# Altium project iMX8M_CPU.PrjPcb (part 1 of 2)
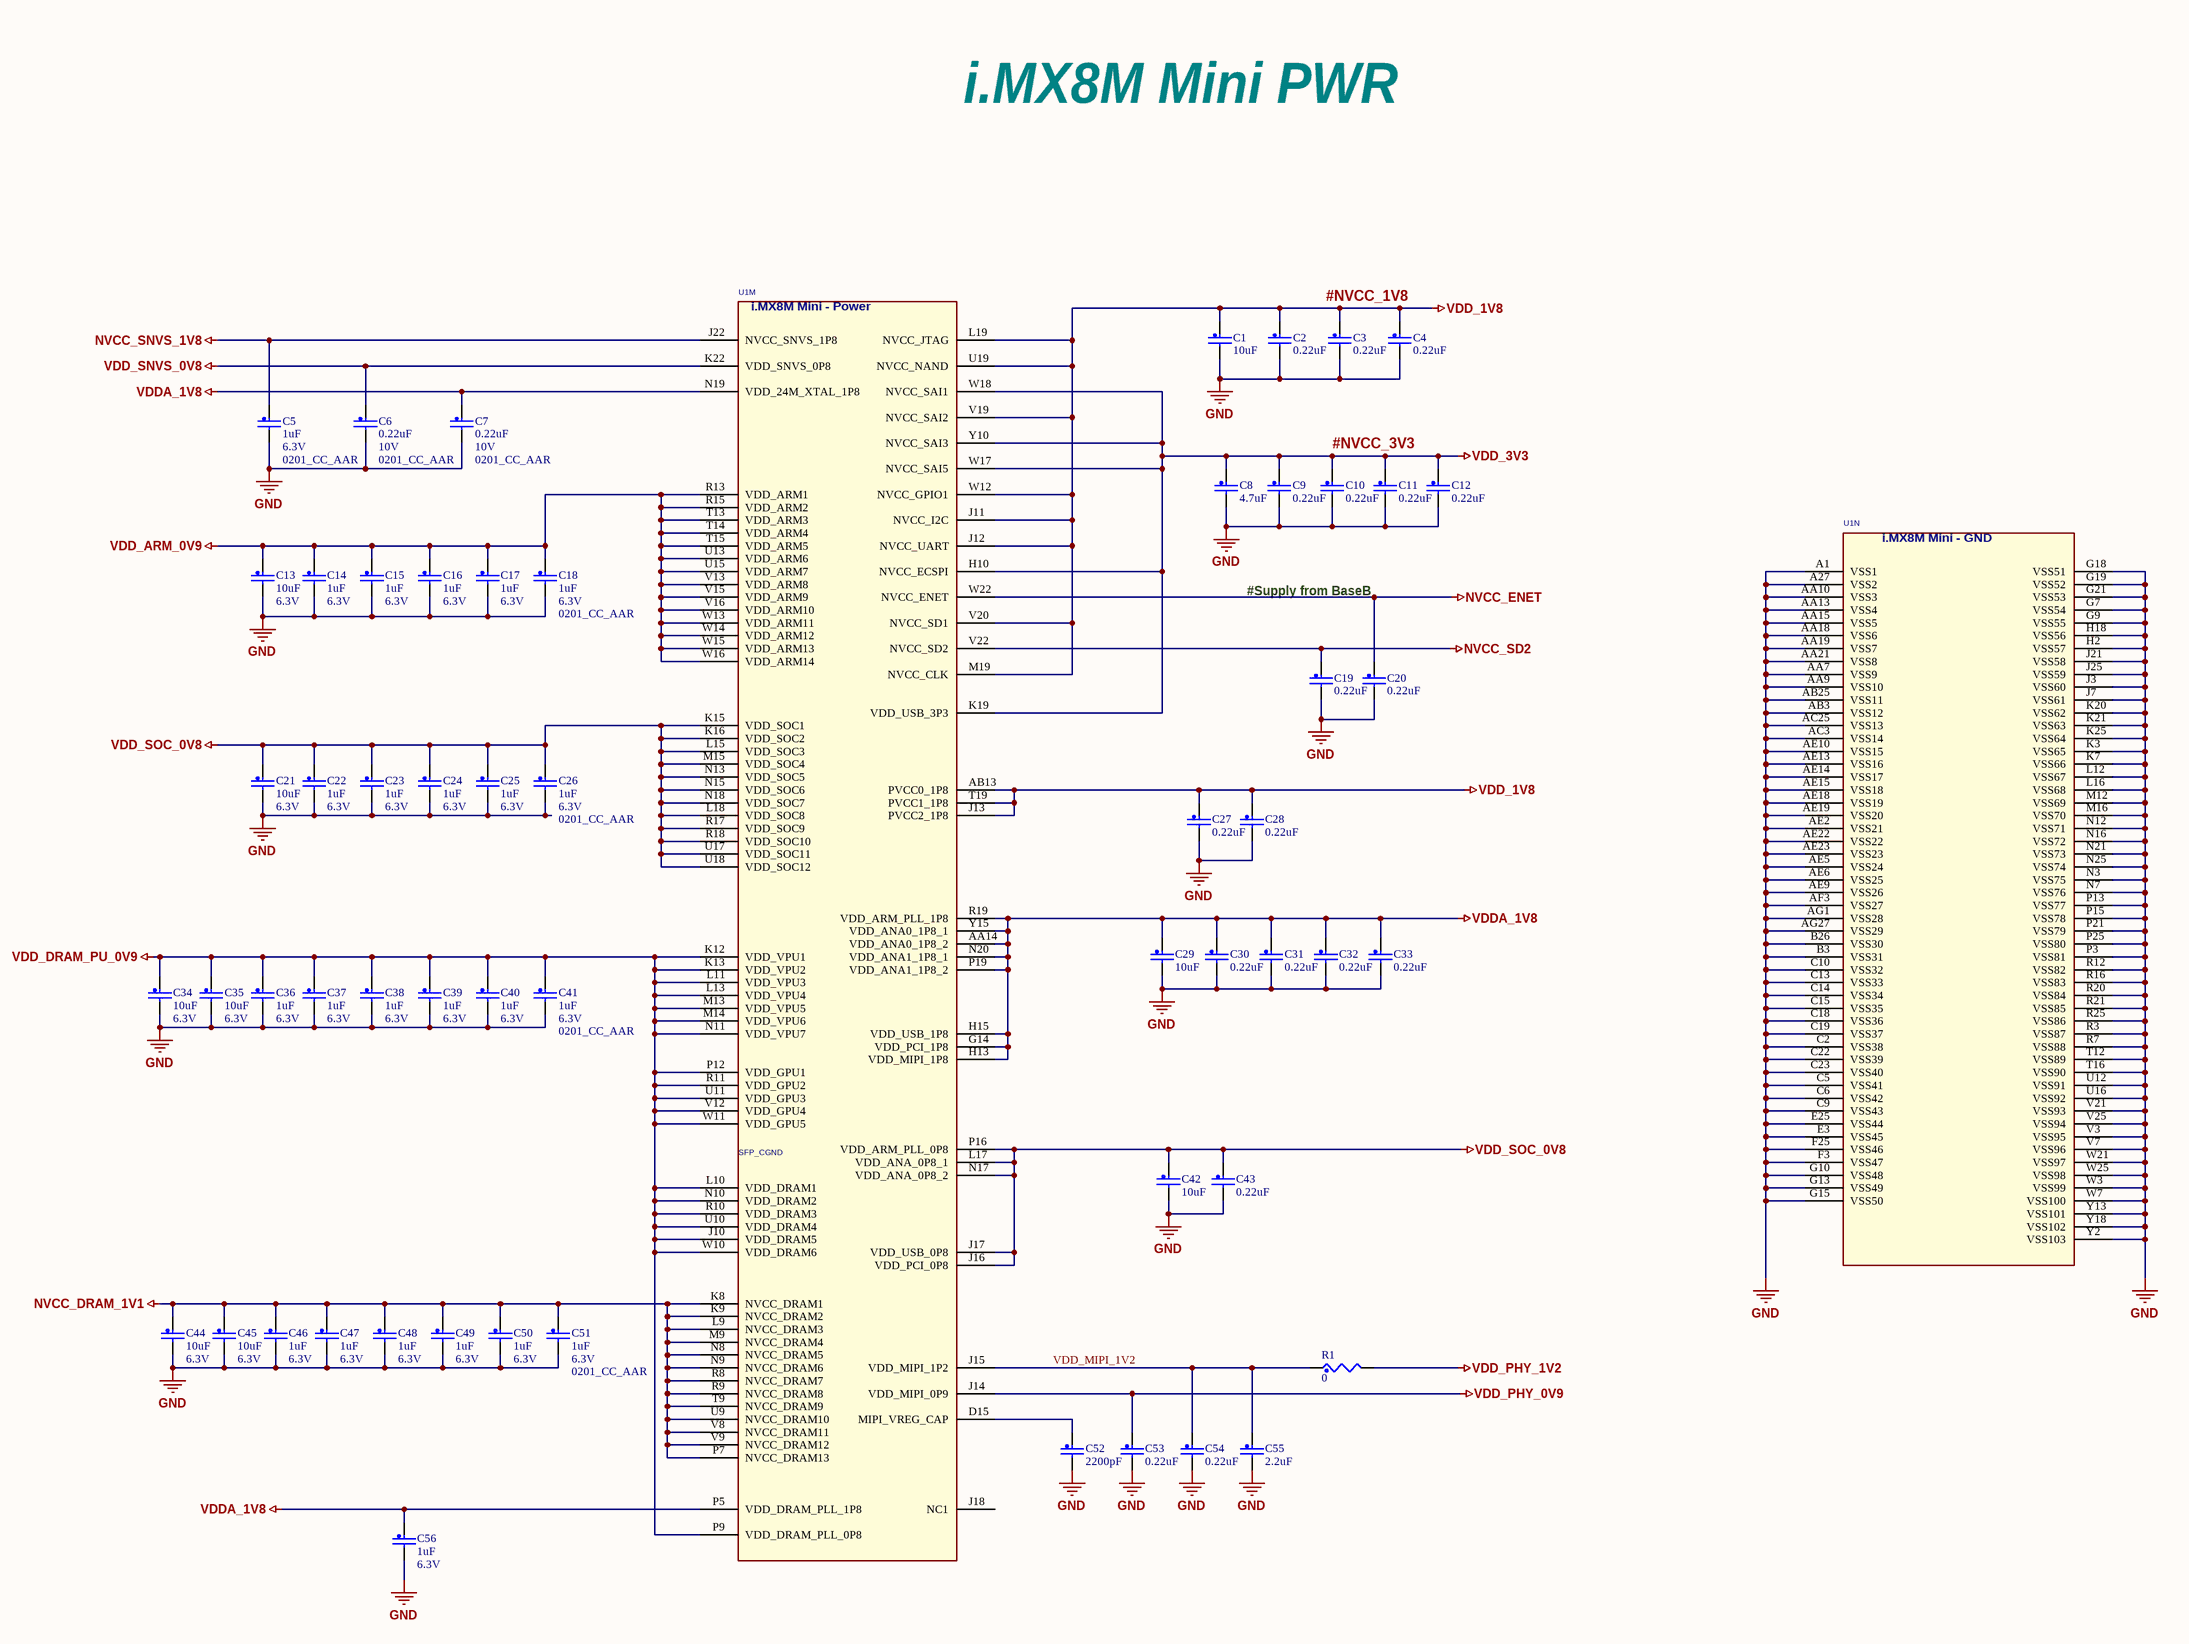
[diagram p0: P[04]_CPU_POWER.SchDoc]
11 sheets, 256 parts. Net scope: global (net labels, ports and power ports of the same name join across sheets).
Board file: iMX8M_CPU.PcbDoc
Sheets:
  P[02]_Block_Diagram.SchDoc
  P[04]_CPU_POWER.SchDoc
  P[05]_PMIC.SchDoc
  P[06]_LPDDR4.SchDoc
  P[07]_CPU_PHY.SchDoc
  P[08]_CPU_MISC.SchDoc
  P[09]_eMMC_QSPI.SchDoc
  P[10]WIFI_Bluetooth.SchDoc
  P[11]_CPU_IO.SchDoc
  P[12]SOM_Interface.SchDoc
  P[13]BOOT_CFG.SchDoc

## Sheet P[02]_Block_Diagram.SchDoc
size A

## Sheet P[04]_CPU_POWER.SchDoc
size 513 x 386 mm

### Parts
C1  10uF  [0402_CC - C]
C2  0.22uF  [0201_CC - C]
C3  0.22uF  [0201_CC - C]
C4  0.22uF  [0201_CC - C]
C5  1uF  Voltage: 6.3V  footprint: 0201_CC_AAR  [0201_CC - C]
C6  0.22uF  Voltage: 10V  footprint: 0201_CC_AAR  [0201_CC - C]
C7  0.22uF  Voltage: 10V  footprint: 0201_CC_AAR  [0201_CC - C]
C8  4.7uF  [0402_CC - C]
C9  0.22uF  [0201_CC - C]
C10  0.22uF  [0201_CC - C]
C11  0.22uF  [0201_CC - C]
C12  0.22uF  [0201_CC - C]
C13  10uF  Voltage: 6.3V  [0402_CC - C]
C14  1uF  Voltage: 6.3V  [0201_CC - C]
C15  1uF  Voltage: 6.3V  [0201_CC - C]
C16  1uF  Voltage: 6.3V  [0201_CC - C]
C17  1uF  Voltage: 6.3V  [0201_CC - C]
C18  1uF  Voltage: 6.3V  footprint: 0201_CC_AAR  [0201_CC - C]
C19  0.22uF  [0201_CC - C]
C20  0.22uF  [0201_CC - C]
C21  10uF  Voltage: 6.3V  [0402_CC - C]
C22  1uF  Voltage: 6.3V  [0201_CC - C]
C23  1uF  Voltage: 6.3V  [0201_CC - C]
C24  1uF  Voltage: 6.3V  [0201_CC - C]
C25  1uF  Voltage: 6.3V  [0201_CC - C]
C26  1uF  Voltage: 6.3V  footprint: 0201_CC_AAR  [0201_CC - C]
C27  0.22uF  [0201_CC - C]
C28  0.22uF  [0201_CC - C]
C29  10uF  [0402_CC - C]
C30  0.22uF  [0201_CC - C]
C31  0.22uF  [0201_CC - C]
C32  0.22uF  [0201_CC - C]
C33  0.22uF  [0201_CC - C]
C34  10uF  Voltage: 6.3V  [0402_CC - C]
C35  10uF  Voltage: 6.3V  [0402_CC - C]
C36  1uF  Voltage: 6.3V  [0201_CC - C]
C37  1uF  Voltage: 6.3V  [0201_CC - C]
C38  1uF  Voltage: 6.3V  [0201_CC - C]
C39  1uF  Voltage: 6.3V  [0201_CC - C]
C40  1uF  Voltage: 6.3V  [0201_CC - C]
C41  1uF  Voltage: 6.3V  footprint: 0201_CC_AAR  [0201_CC - C]
C42  10uF  [0402_CC - C]
C43  0.22uF  [0201_CC - C]
C44  10uF  Voltage: 6.3V  [0402_CC - C]
C45  10uF  Voltage: 6.3V  [0402_CC - C]
C46  1uF  Voltage: 6.3V  [0201_CC - C]
C47  1uF  Voltage: 6.3V  [0201_CC - C]
C48  1uF  Voltage: 6.3V  [0201_CC - C]
C49  1uF  Voltage: 6.3V  [0201_CC - C]
C50  1uF  Voltage: 6.3V  [0201_CC - C]
C51  1uF  Voltage: 6.3V  footprint: 0201_CC_AAR  [0201_CC - C]
C52  2200pF  [0201_CC - C]
C53  0.22uF  [0201_CC - C]
C54  0.22uF  [0201_CC - C]
C55  2.2uF  [0402_CC - C]
C56  1uF  Voltage: 6.3V  [0201_CC - C]
R1  0  [0402_CC]
U1  SFP_CGND  [BGA486_0P5_14X14]  (parts M,N of 14)

### Nets
GND: C1.2 C2.2 C3.2 C4.2 C5.2 C6.2 C7.2 C8.2 C9.2 C10.2 C11.2 C12.2 C13.2 C14.2 C15.2 C16.2 C17.2 C18.2 C19.2 C20.2 C21.2 C22.2 C23.2 C24.2 C25.2 C26.2 C27.2 C28.2 C29.2 C30.2 C31.2 C32.2 C33.2 C34.2 C35.2 C36.2 C37.2 C38.2 C39.2 C40.2 C41.2 C42.2 C43.2 C44.2 C45.2 C46.2 C47.2 C48.2 C49.2 C50.2 C51.2 C52.2 C53.2 C54.2 C55.2 C56.2 U1.A1(VSS1) U1.A27(VSS2) U1.AA7(VSS9) U1.AA9(VSS10) U1.AA10(VSS3) U1.AA13(VSS4) U1.AA15(VSS5) U1.AA18(VSS6) U1.AA19(VSS7) U1.AA21(VSS8) U1.AB3(VSS12) U1.AB25(VSS11) U1.AC3(VSS14) U1.AC25(VSS13) U1.AE2(VSS21) U1.AE5(VSS24) U1.AE6(VSS25) U1.AE9(VSS26) U1.AE10(VSS15) U1.AE13(VSS16) U1.AE14(VSS17) U1.AE15(VSS18) U1.AE18(VSS19) U1.AE19(VSS20) U1.AE22(VSS22) U1.AE23(VSS23) U1.AF3(VSS27) U1.AG1(VSS28) U1.AG27(VSS29) U1.B3(VSS31) U1.B26(VSS30) U1.C2(VSS38) U1.C5(VSS41) U1.C6(VSS42) U1.C9(VSS43) U1.C10(VSS32) U1.C13(VSS33) U1.C14(VSS34) U1.C15(VSS35) U1.C18(VSS36) U1.C19(VSS37) U1.C22(VSS39) U1.C23(VSS40) U1.E3(VSS45) U1.E25(VSS44) U1.F3(VSS47) U1.F25(VSS46) U1.G7(VSS54) U1.G9(VSS55) U1.G10(VSS48) U1.G13(VSS49) U1.G15(VSS50) U1.G18(VSS51) U1.G19(VSS52) U1.G21(VSS53) U1.H2(VSS57) U1.H18(VSS56) U1.J3(VSS60) U1.J7(VSS61) U1.J21(VSS58) U1.J25(VSS59) U1.K3(VSS65) U1.K7(VSS66) U1.K20(VSS62) U1.K21(VSS63) U1.K25(VSS64) U1.L12(VSS67) U1.L16(VSS68) U1.M12(VSS69) U1.M16(VSS70) U1.N3(VSS75) U1.N7(VSS76) U1.N12(VSS71) U1.N16(VSS72) U1.N21(VSS73) U1.N25(VSS74) U1.P3(VSS81) U1.P13(VSS77) U1.P15(VSS78) U1.P21(VSS79) U1.P25(VSS80) U1.R3(VSS87) U1.R7(VSS88) U1.R12(VSS82) U1.R16(VSS83) U1.R20(VSS84) U1.R21(VSS85) U1.R25(VSS86) U1.T12(VSS89) U1.T16(VSS90) U1.U12(VSS91) U1.U16(VSS92) U1.V3(VSS95) U1.V7(VSS96) U1.V21(VSS93) U1.V25(VSS94) U1.W3(VSS99) U1.W7(VSS100) U1.W21(VSS97) U1.W25(VSS98) U1.Y2(VSS103) U1.Y13(VSS101) U1.Y18(VSS102)
NVCC_DRAM_1V1: C44.1 C45.1 C46.1 C47.1 C48.1 C49.1 C50.1 C51.1 U1.K8(NVCC_DRAM1) U1.K9(NVCC_DRAM2) U1.L9(NVCC_DRAM3) U1.M9(NVCC_DRAM4) U1.N8(NVCC_DRAM5) U1.N9(NVCC_DRAM6) U1.P7(NVCC_DRAM13) U1.R8(NVCC_DRAM7) U1.R9(NVCC_DRAM8) U1.T9(NVCC_DRAM9) U1.U9(NVCC_DRAM10) U1.V8(NVCC_DRAM11) U1.V9(NVCC_DRAM12)
NVCC_ENET: C20.1 U1.W22(NVCC_ENET)
NVCC_SD2: C19.1 U1.V22(NVCC_SD2)
NVCC_SNVS_1V8: C5.1 U1.J22(NVCC_SNVS_1P8)
VDD_1V8: C1.1 C2.1 C3.1 C4.1 C27.1 C28.1 U1.AB13(PVCC0_1P8) U1.J11(NVCC_I2C) U1.J12(NVCC_UART) U1.J13(PVCC2_1P8) U1.L19(NVCC_JTAG) U1.M19(NVCC_CLK) U1.T19(PVCC1_1P8) U1.U19(NVCC_NAND) U1.V19(NVCC_SAI2) U1.V20(NVCC_SD1) U1.W12(NVCC_GPIO1)
VDD_3V3: C8.1 C9.1 C10.1 C11.1 C12.1 U1.H10(NVCC_ECSPI) U1.K19(VDD_USB_3P3) U1.W17(NVCC_SAI5) U1.W18(NVCC_SAI1) U1.Y10(NVCC_SAI3)
VDD_ARM_0V9: C13.1 C14.1 C15.1 C16.1 C17.1 C18.1 U1.R13(VDD_ARM1) U1.R15(VDD_ARM2) U1.T13(VDD_ARM3) U1.T14(VDD_ARM4) U1.T15(VDD_ARM5) U1.U13(VDD_ARM6) U1.U15(VDD_ARM7) U1.V13(VDD_ARM8) U1.V15(VDD_ARM9) U1.V16(VDD_ARM10) U1.W13(VDD_ARM11) U1.W14(VDD_ARM12) U1.W15(VDD_ARM13) U1.W16(VDD_ARM14)
VDD_DRAM_PU_0V9: C34.1 C35.1 C36.1 C37.1 C38.1 C39.1 C40.1 C41.1 U1.J10(VDD_DRAM5) U1.K12(VDD_VPU1) U1.K13(VDD_VPU2) U1.L10(VDD_DRAM1) U1.L11(VDD_VPU3) U1.L13(VDD_VPU4) U1.M13(VDD_VPU5) U1.M14(VDD_VPU6) U1.N10(VDD_DRAM2) U1.N11(VDD_VPU7) U1.P9(VDD_DRAM_PLL_0P8) U1.P12(VDD_GPU1) U1.R10(VDD_DRAM3) U1.R11(VDD_GPU2) U1.U10(VDD_DRAM4) U1.U11(VDD_GPU3) U1.V12(VDD_GPU4) U1.W10(VDD_DRAM6) U1.W11(VDD_GPU5)
VDD_PHY_0V9: C53.1 U1.J14(VDD_MIPI_0P9)
VDD_PHY_1V2: R1.2
VDD_SNVS_0V8: C6.1 U1.K22(VDD_SNVS_0P8)
VDD_SOC_0V8: C21.1 C22.1 C23.1 C24.1 C25.1 C26.1 C42.1 C43.1 U1.J16(VDD_PCI_0P8) U1.J17(VDD_USB_0P8) U1.K15(VDD_SOC1) U1.K16(VDD_SOC2) U1.L15(VDD_SOC3) U1.L17(VDD_ANA_0P8_1) U1.L18(VDD_SOC8) U1.M15(VDD_SOC4) U1.N13(VDD_SOC5) U1.N15(VDD_SOC6) U1.N17(VDD_ANA_0P8_2) U1.N18(VDD_SOC7) U1.P16(VDD_ARM_PLL_0P8) U1.R17(VDD_SOC9) U1.R18(VDD_SOC10) U1.U17(VDD_SOC11) U1.U18(VDD_SOC12)
VDDA_1V8: C7.1 C29.1 C30.1 C31.1 C32.1 C33.1 C56.1 U1.AA14(VDD_ANA0_1P8_2) U1.G14(VDD_PCI_1P8) U1.H13(VDD_MIPI_1P8) U1.H15(VDD_USB_1P8) U1.N19(VDD_24M_XTAL_1P8) U1.N20(VDD_ANA1_1P8_1) U1.P5(VDD_DRAM_PLL_1P8) U1.P19(VDD_ANA1_1P8_2) U1.R19(VDD_ARM_PLL_1P8) U1.Y15(VDD_ANA0_1P8_1)
VDD_MIPI_1V2: C54.1 C55.1 R1.1 U1.J15(VDD_MIPI_1P2)
NetC52_1: C52.1 U1.D15(MIPI_VREG_CAP)

Not connected (* = marked no-connect by the designer): U1 J18(NC1)

### Notes on the sheet
- i.MX8M Mini PWR
- #NVCC_1V8
- #NVCC_3V3
- #Supply from BaseB
- Title
- Size:
- Date:
- A3
- Number:
- Time:
- Revision:
- Sheet
- of
- File:
- (in symbol MIMX8MM_BGA486P, part M) i.MX8M Mini - Power
- (in symbol MIMX8MM_BGA486P, part N) i.MX8M Mini - GND

### Library data of the parts
C1-C56 = CAP_NP: CLASS: DISCRETE
  C13 C21 C34 C35 C44 C45: footprint: 0402_CC_AAR
  C14-C17 C22-C25 C36-C40 C46-C50 C56: footprint: 0201_CC_AAR
R1 = RES: CLASS: DISCRETE
U1 = MIMX8MM_BGA486P: IC CPU QUAD CORTEX A53+M4 1.8GHZ BGA486 / By Arman Arvand; SPLIT_INST: TRUE; CAD_APPROVED: Yes; PRE_APN: 330-77072; MFG_PN01: MIMX8MM6DVTLZAA; MFG_NAME01: NXP SEMICONDUCTORS; AGILE_PN: TMP-WF-32905; CLASS: IC; HEIGHT: 1.25MM; ROHS: Yes

## Sheet P[05]_PMIC.SchDoc
size 513 x 386 mm
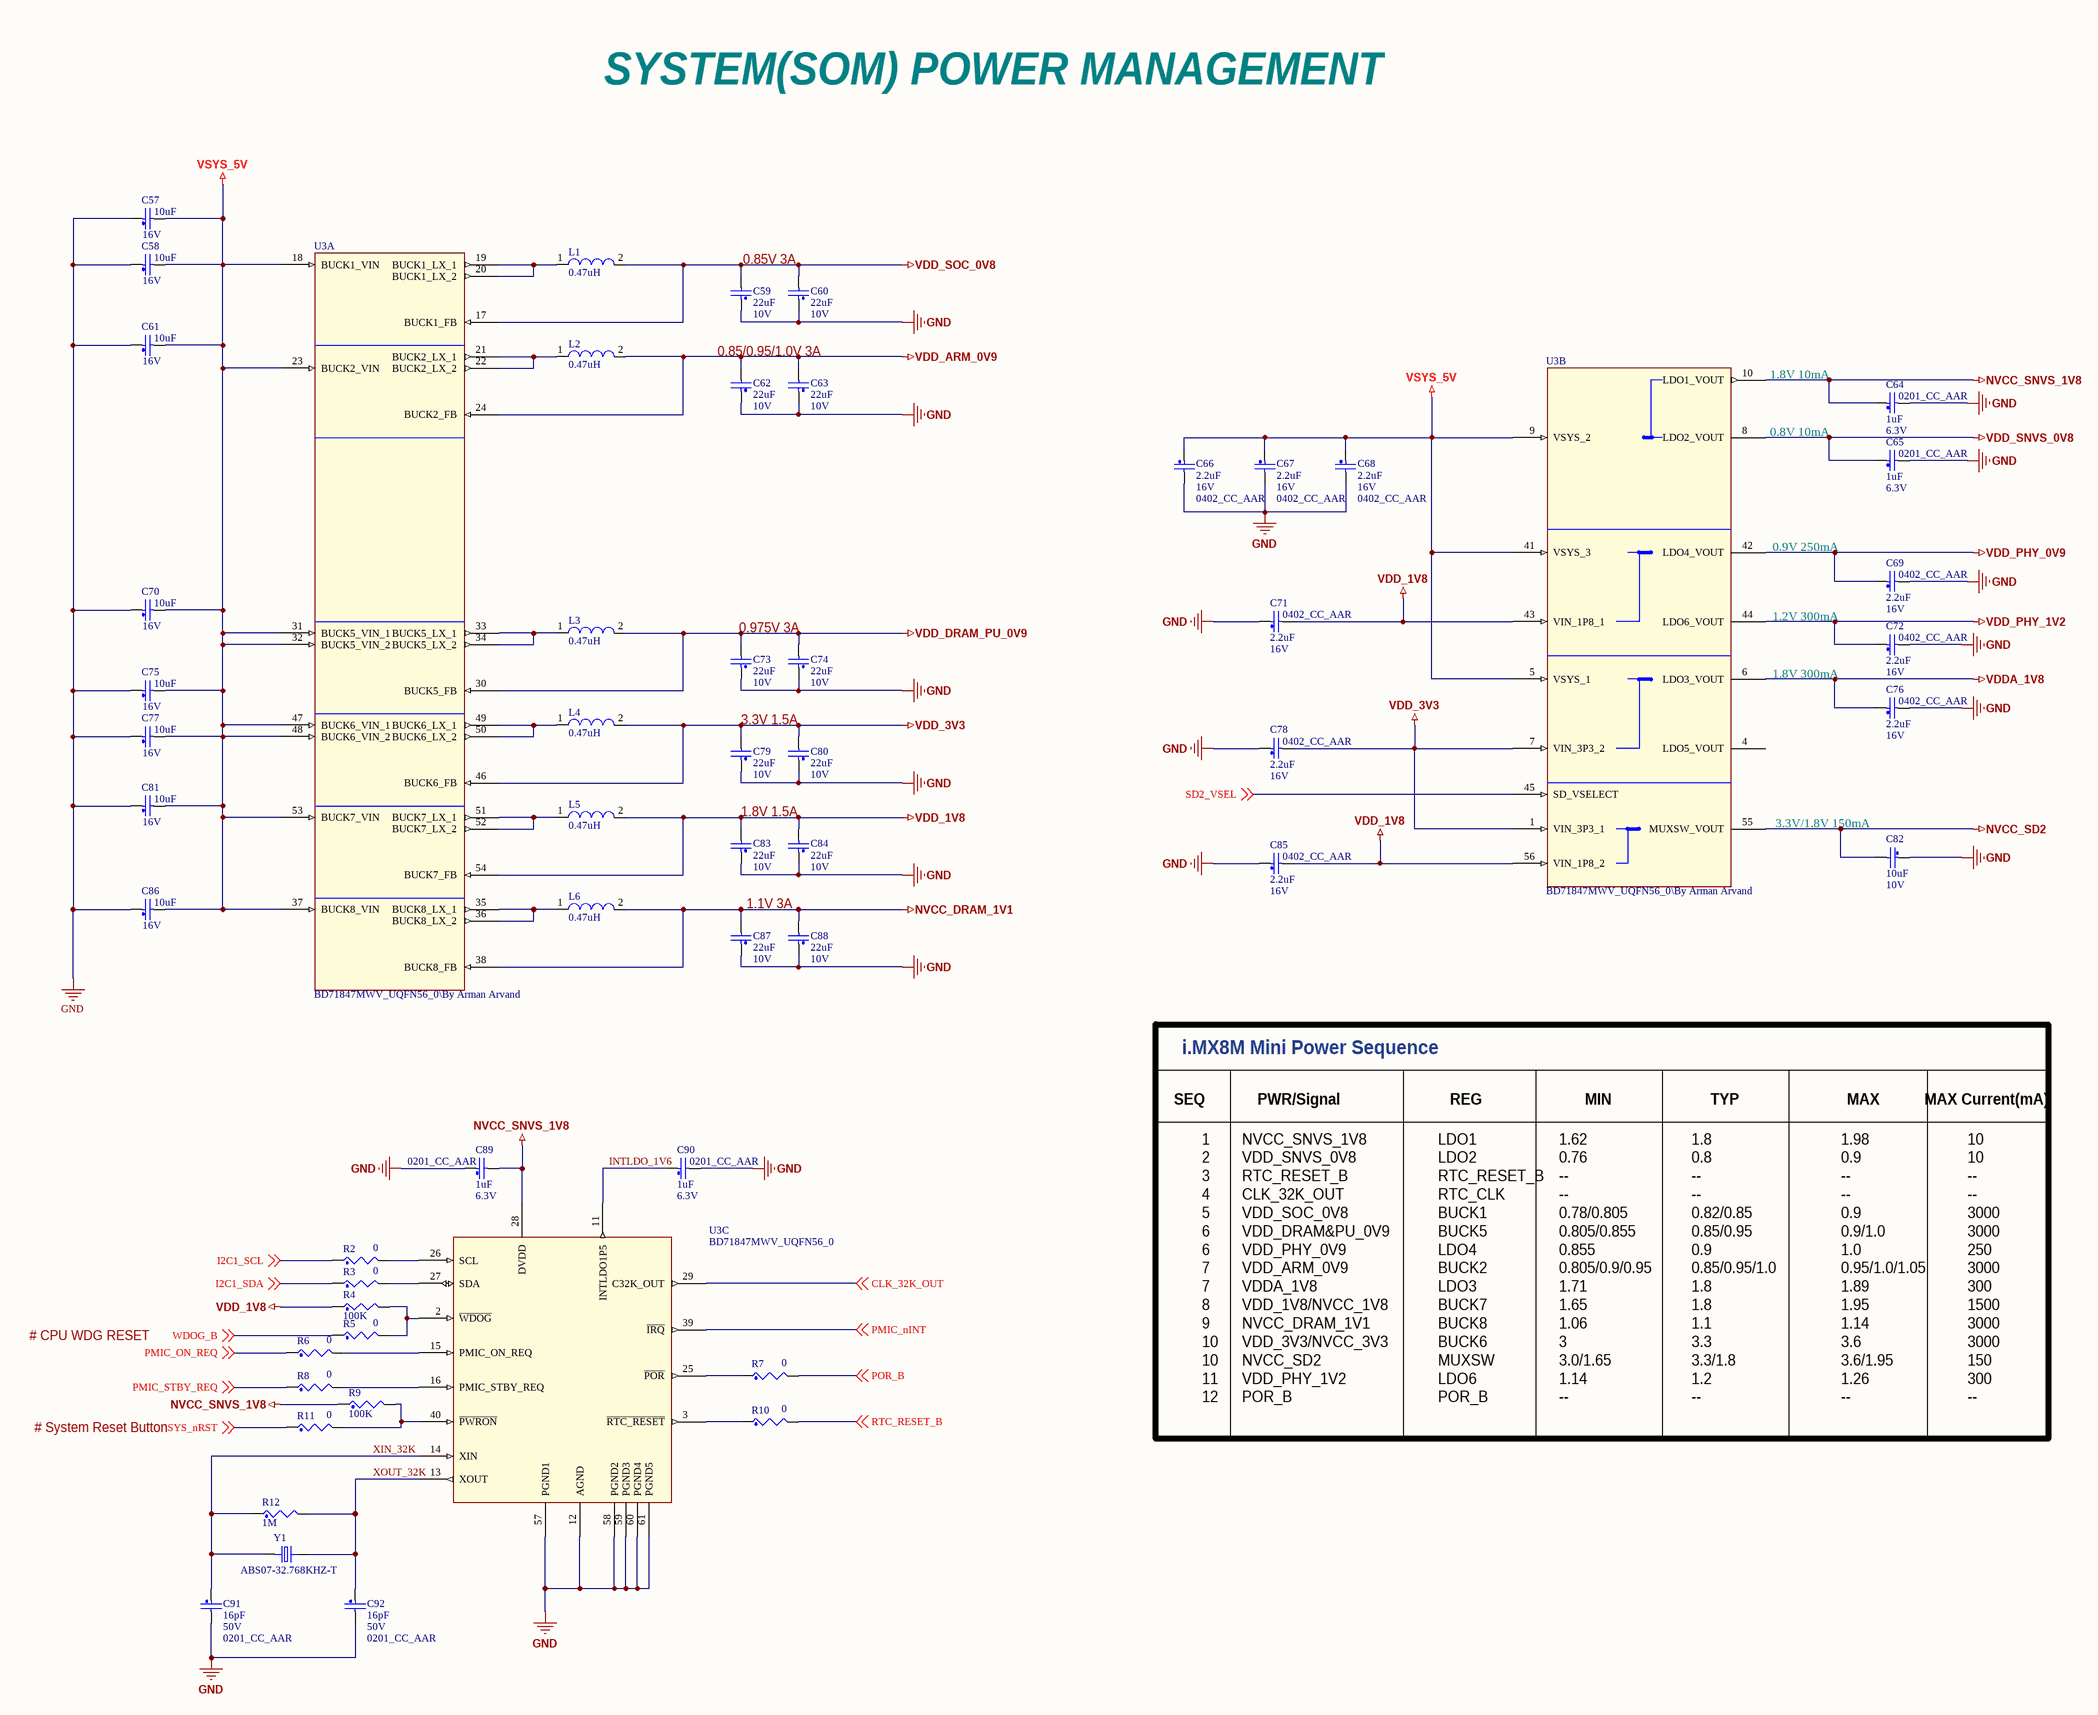
[diagram p1: P[05]_PMIC.SchDoc]

### Parts
C57  10uF  Voltage: 16V  [0603_CC]
C58  10uF  Voltage: 16V  [0603_CC]
C59  22uF  Voltage: 10V  [0603_CC]
C60  22uF  Voltage: 10V  [0603_CC]
C61  10uF  Voltage: 16V  [0603_CC]
C62  22uF  Voltage: 10V  [0603_CC]
C63  22uF  Voltage: 10V  [0603_CC]
C64  1uF  Voltage: 6.3V  footprint: 0201_CC_AAR  [0201_CC - C]
C65  1uF  Voltage: 6.3V  footprint: 0201_CC_AAR  [0201_CC - C]
C66  2.2uF  Voltage: 16V  footprint: 0402_CC_AAR  [0402_CC - C]
C67  2.2uF  Voltage: 16V  footprint: 0402_CC_AAR  [0402_CC - C]
C68  2.2uF  Voltage: 16V  footprint: 0402_CC_AAR  [0402_CC - C]
C69  2.2uF  Voltage: 16V  footprint: 0402_CC_AAR  [0402_CC - C]
C70  10uF  Voltage: 16V  [0603_CC]
C71  2.2uF  Voltage: 16V  footprint: 0402_CC_AAR  [0402_CC - C]
C72  2.2uF  Voltage: 16V  footprint: 0402_CC_AAR  [0402_CC - C]
C73  22uF  Voltage: 10V  [0603_CC]
C74  22uF  Voltage: 10V  [0603_CC]
C75  10uF  Voltage: 16V  [0603_CC]
C76  2.2uF  Voltage: 16V  footprint: 0402_CC_AAR  [0402_CC - C]
C77  10uF  Voltage: 16V  [0603_CC]
C78  2.2uF  Voltage: 16V  footprint: 0402_CC_AAR  [0402_CC - C]
C79  22uF  Voltage: 10V  [0603_CC]
C80  22uF  Voltage: 10V  [0603_CC]
C81  10uF  Voltage: 16V  [0603_CC]
C82  10uF  Voltage: 10V  [0603_CC]
C83  22uF  Voltage: 10V  [0603_CC]
C84  22uF  Voltage: 10V  [0603_CC]
C85  2.2uF  Voltage: 16V  footprint: 0402_CC_AAR  [0402_CC - C]
C86  10uF  Voltage: 16V  [0603_CC]
C87  22uF  Voltage: 10V  [0603_CC]
C88  22uF  Voltage: 10V  [0603_CC]
C89  1uF  Voltage: 6.3V  footprint: 0201_CC_AAR  [0201_CC - C]
C90  1uF  Voltage: 6.3V  footprint: 0201_CC_AAR  [0201_CC - C]
C91  16pF  Voltage: 50V  footprint: 0201_CC_AAR  [0201_CC - C]
C92  16pF  Voltage: 50V  footprint: 0201_CC_AAR  [0201_CC - C]
L1  0.47uH  [IND_SPH2520]
L2  0.47uH  [IND_SPH2520]
L3  0.47uH  [IND_SPH2520]
L4  0.47uH  [IND_SPH2520]
L5  0.47uH  [IND_SPH2520]
L6  0.47uH  [IND_SPH2520]
R2  0  [0402_CC]
R3  0  [0402_CC]
R4  100K  [0201_CC]
R5  0  [0402_CC]
R6  0  [0402_CC]
R7  0  [0402_CC]
R8  0  [0402_CC]
R9  100K  [0201_CC]
R10  0  [0402_CC]
R11  0  [0402_CC]
R12  1M  [0201_CC]
U3  BD71847MWV_UQFN56_0\By Arman Arvand  [UQFN56_0P4_7X7_EP_S185]  (parts A,B,C of 3)
Y1  ABS07-32.768KHZ-T  [XTAL_ABS07-32.768KHZ-T]

### Nets
GND: C57.1 C58.1 C59.1 C60.1 C61.1 C62.1 C63.1 C64.2 C65.2 C66.2 C67.2 C68.2 C69.2 C70.1 C71.1 C72.2 C73.1 C74.1 C75.1 C76.2 C77.1 C78.1 C79.1 C80.1 C81.1 C82.1 C83.1 C84.1 C85.1 C86.1 C87.1 C88.1 C89.1 C90.2 C91.2 C92.2 U3.12(AGND) U3.57(PGND1) U3.58(PGND2) U3.59(PGND3) U3.60(PGND4) U3.61(PGND5)
NVCC_DRAM_1V1: C87.2 C88.2 L6.2 U3.38(BUCK8_FB)
NVCC_SD2: C82.2 U3.55(MUXSW_VOUT)
NVCC_SNVS_1V8: C64.1 C89.2 R9.1 U3.10(LDO1_VOUT) U3.28(DVDD)
VDD_1V8: C71.2 C83.2 C84.2 C85.2 L5.2 R4.1 U3.43(VIN_1P8_1) U3.54(BUCK7_FB) U3.56(VIN_1P8_2)
VDD_3V3: C78.2 C79.2 C80.2 L4.2 U3.1(VIN_3P3_1) U3.7(VIN_3P3_2) U3.46(BUCK6_FB)
VDD_ARM_0V9: C62.2 C63.2 L2.2 U3.24(BUCK2_FB)
VDD_DRAM_PU_0V9: C73.2 C74.2 L3.2 U3.30(BUCK5_FB)
VDD_PHY_0V9: C69.1 U3.42(LDO4_VOUT)
VDD_PHY_1V2: C72.1 U3.44(LDO6_VOUT)
VDD_SNVS_0V8: C65.1 U3.8(LDO2_VOUT)
VDD_SOC_0V8: C59.2 C60.2 L1.2 U3.17(BUCK1_FB)
VDDA_1V8: C76.1 U3.6(LDO3_VOUT)
VSYS_5V: C57.2 C58.2 C61.2 C66.1 C67.1 C68.1 C70.2 C75.2 C77.2 C81.2 C86.2 U3.5(VSYS_1) U3.9(VSYS_2) U3.18(BUCK1_VIN) U3.23(BUCK2_VIN) U3.31(BUCK5_VIN_1) U3.32(BUCK5_VIN_2) U3.37(BUCK8_VIN) U3.41(VSYS_3) U3.47(BUCK6_VIN_1) U3.48(BUCK6_VIN_2) U3.53(BUCK7_VIN)
CLK_32K_OUT: U3.29(C32K_OUT) ; off-sheet CLK_32K_OUT
I2C1_SCL: R2.1 ; off-sheet I2C1_SCL
I2C1_SDA: R3.1 ; off-sheet I2C1_SDA
INTLDO_1V6: C90.1 U3.11(INTLDO1P5)
PMIC_nINT: U3.39(~{IRQ}) ; off-sheet PMIC_nINT
PMIC_ON_REQ: R6.1 ; off-sheet PMIC_ON_REQ
PMIC_STBY_REQ: R8.1 ; off-sheet PMIC_STBY_REQ
POR_B: R7.2 ; off-sheet POR_B
RTC_RESET_B: R10.2 ; off-sheet RTC_RESET_B
SD2_VSEL: U3.45(SD_VSELECT) ; off-sheet SD2_VSEL
SYS_nRST: R11.1 ; off-sheet SYS_nRST
WDOG_B: R5.1 ; off-sheet WDOG_B
XIN_32K: C91.1 R12.1 U3.14(XIN) Y1.1
XOUT_32K: C92.1 R12.2 U3.13(XOUT) Y1.2
NetL1_1: L1.1 U3.19(BUCK1_LX_1) U3.20(BUCK1_LX_2)
NetL2_1: L2.1 U3.21(BUCK2_LX_1) U3.22(BUCK2_LX_2)
NetL3_1: L3.1 U3.33(BUCK5_LX_1) U3.34(BUCK5_LX_2)
NetL4_1: L4.1 U3.49(BUCK6_LX_1) U3.50(BUCK6_LX_2)
NetL5_1: L5.1 U3.51(BUCK7_LX_1) U3.52(BUCK7_LX_2)
NetL6_1: L6.1 U3.35(BUCK8_LX_1) U3.36(BUCK8_LX_2)
NetR2_2: R2.2 U3.26(SCL)
NetR3_2: R3.2 U3.27(SDA)
NetR4_2: R4.2 R5.2 U3.2(~{WDOG})
NetR6_2: R6.2 U3.15(PMIC_ON_REQ)
NetR7_1: R7.1 U3.25(~{POR})
NetR8_2: R8.2 U3.16(PMIC_STBY_REQ)
NetR9_2: R9.2 R11.2 U3.40(~{PWRON})
NetR10_1: R10.1 U3.3(~{RTC_RESET})

Not connected (* = marked no-connect by the designer): U3 4(LDO5_VOUT)

### Notes on the sheet
- SYSTEM(SOM) POWER MANAGEMENT
- 0.85V 3A
- 0.85/0.95/1.0V 3A
- 1.8V 10mA
- 0.8V 10mA
- 0.9V 250mA
- 0.975V 3A
- 1.2V 300mA
- 1.8V 300mA
- 3.3V 1.5A
- 1.8V 1.5A
- 3.3V/1.8V 150mA
- 1.1V 3A
- i.MX8M Mini Power Sequence
- SEQ
- PWR/Signal
- REG
- MIN
- TYP
- MAX
- MAX Current(mA)
- # CPU WDG RESET
- # System Reset Button
- 1
  2
  3
  4
  5
  6
  6
  7
  7
  8
  9
  10
  10
  11
  12
- NVCC_SNVS_1V8
  VDD_SNVS_0V8
  RTC_RESET_B
  CLK_32K_OUT
  VDD_SOC_0V8
  VDD_DRAM&PU_0V9
  VDD_PHY_0V9
  VDD_ARM_0V9
  VDDA_1V8
  VDD_1V8/NVCC_1V8
  NVCC_DRAM_1V1
  VDD_3V3/NVCC_3V3
  NVCC_SD2
  VDD_PHY_1V2
  POR_B
- LDO1
  LDO2
  RTC_RESET_B
  RTC_CLK
  BUCK1
  BUCK5
  LDO4
  BUCK2
  LDO3
  BUCK7
  BUCK8
  BUCK6
  MUXSW
  LDO6
  POR_B
- 1.62
  0.76
  --
  --
  0.78/0.805
  0.805/0.855
  0.855
  0.805/0.9/0.95
  1.71
  1.65
  1.06
  3
  3.0/1.65
  1.14
  --
- 1.8
  0.8
  --
  --
  0.82/0.85
  0.85/0.95
  0.9
  0.85/0.95/1.0
  1.8
  1.8
  1.1
  3.3
  3.3/1.8
  1.2
  --
- 1.98
  0.9
  --
  --
  0.9
  0.9/1.0
  1.0
  0.95/1.0/1.05
  1.89
  1.95
  1.14
  3.6
  3.6/1.95
  1.26
  --
- 10
  10
  --
  --
  3000
  3000
  250
  3000
  300
  1500
  3000
  3000
  150
  300
  --

### Library data of the parts
C57-C92 = CAP_NP: CLASS: DISCRETE
L1-L6 = INDUCTOR: CLASS: DISCRETE
R2-R12 = RES: CLASS: DISCRETE
U3 = BD71847MWV_UQFN56_0: CLASS: IC
Y1 = ABS07-32.768KHZ-T: 32.768kHz Â±20ppm Crystal 12.5pF 70 kOhms 2-SMD, No Lead; MF: Abracon LLC; Price: None; Value: *; Package: SMD-2 Abracon; Availability: Unavailable; SnapEDA_Link: https://www.snapeda.com/parts/ABS07-32.768KHZ/Abracon%20LLC/view-part/448682/?ref=snap; MP: ABS07-32.768KHZ

## Sheet P[06]_LPDDR4.SchDoc
size 513 x 386 mm
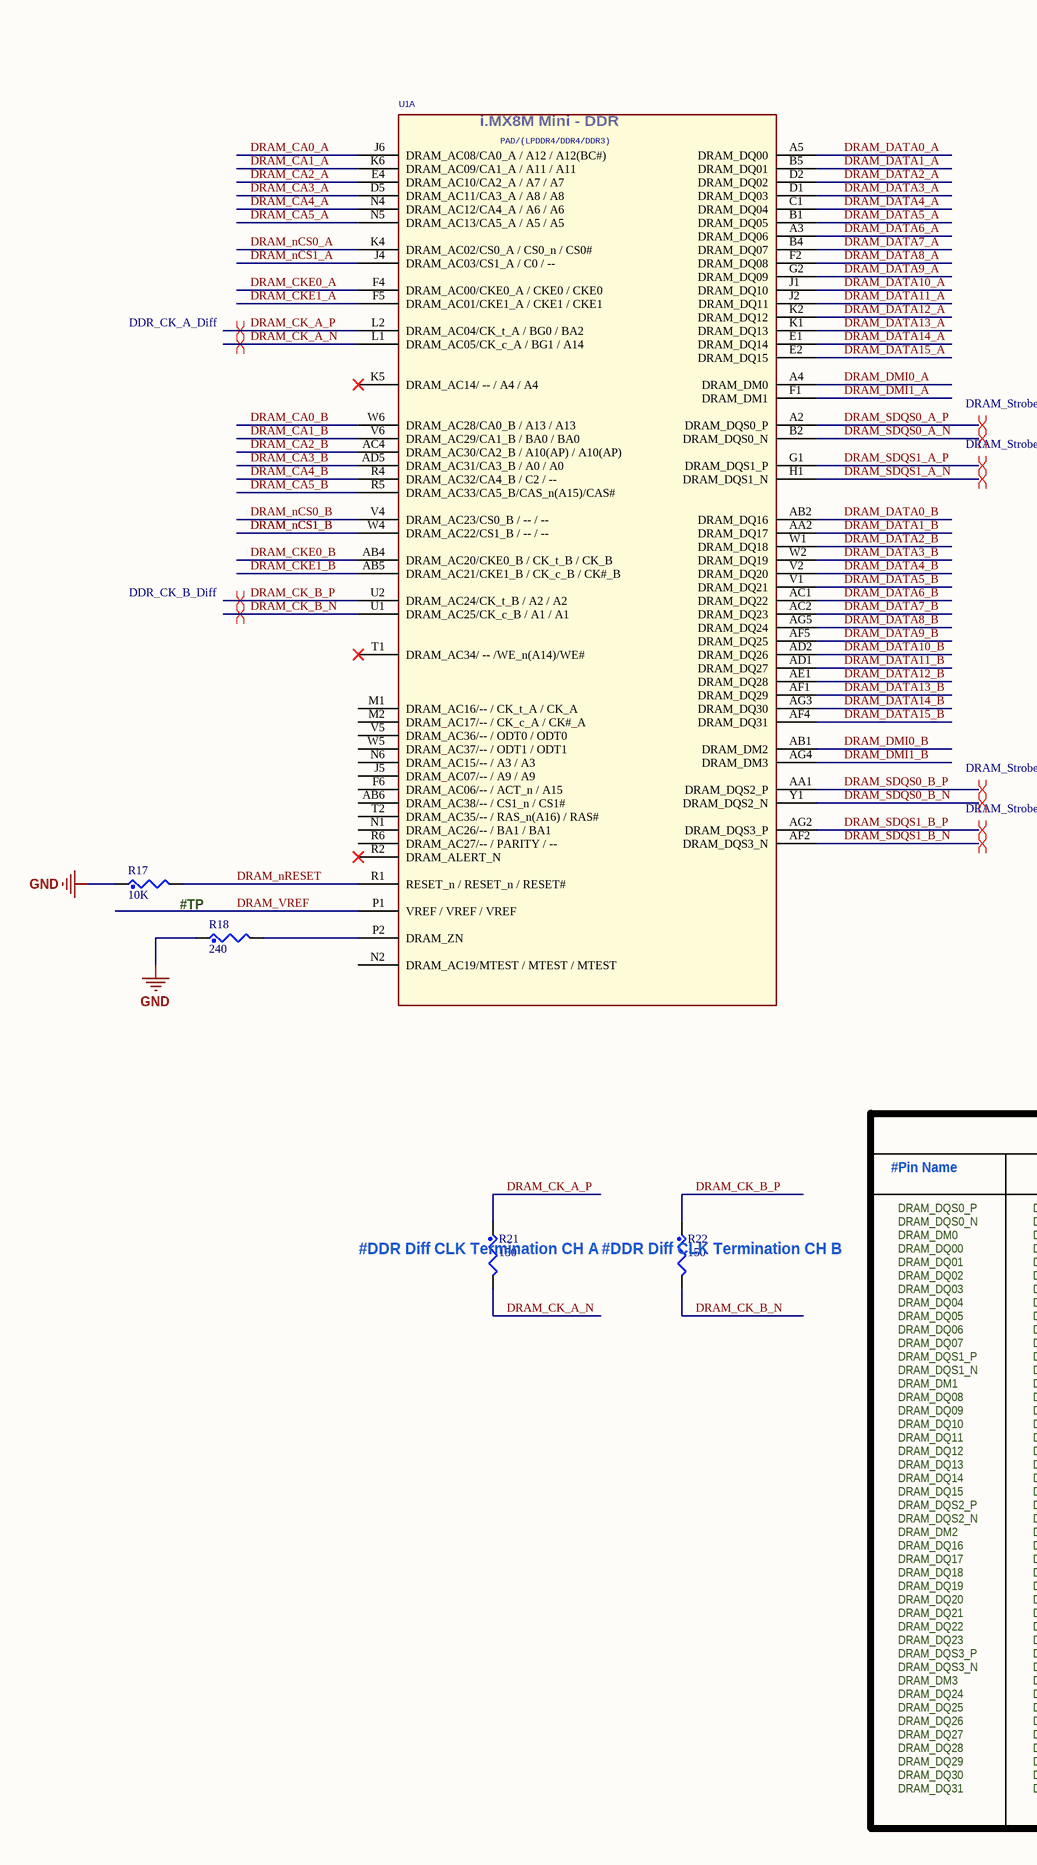
[diagram p2: P[06]_LPDDR4.SchDoc, left]
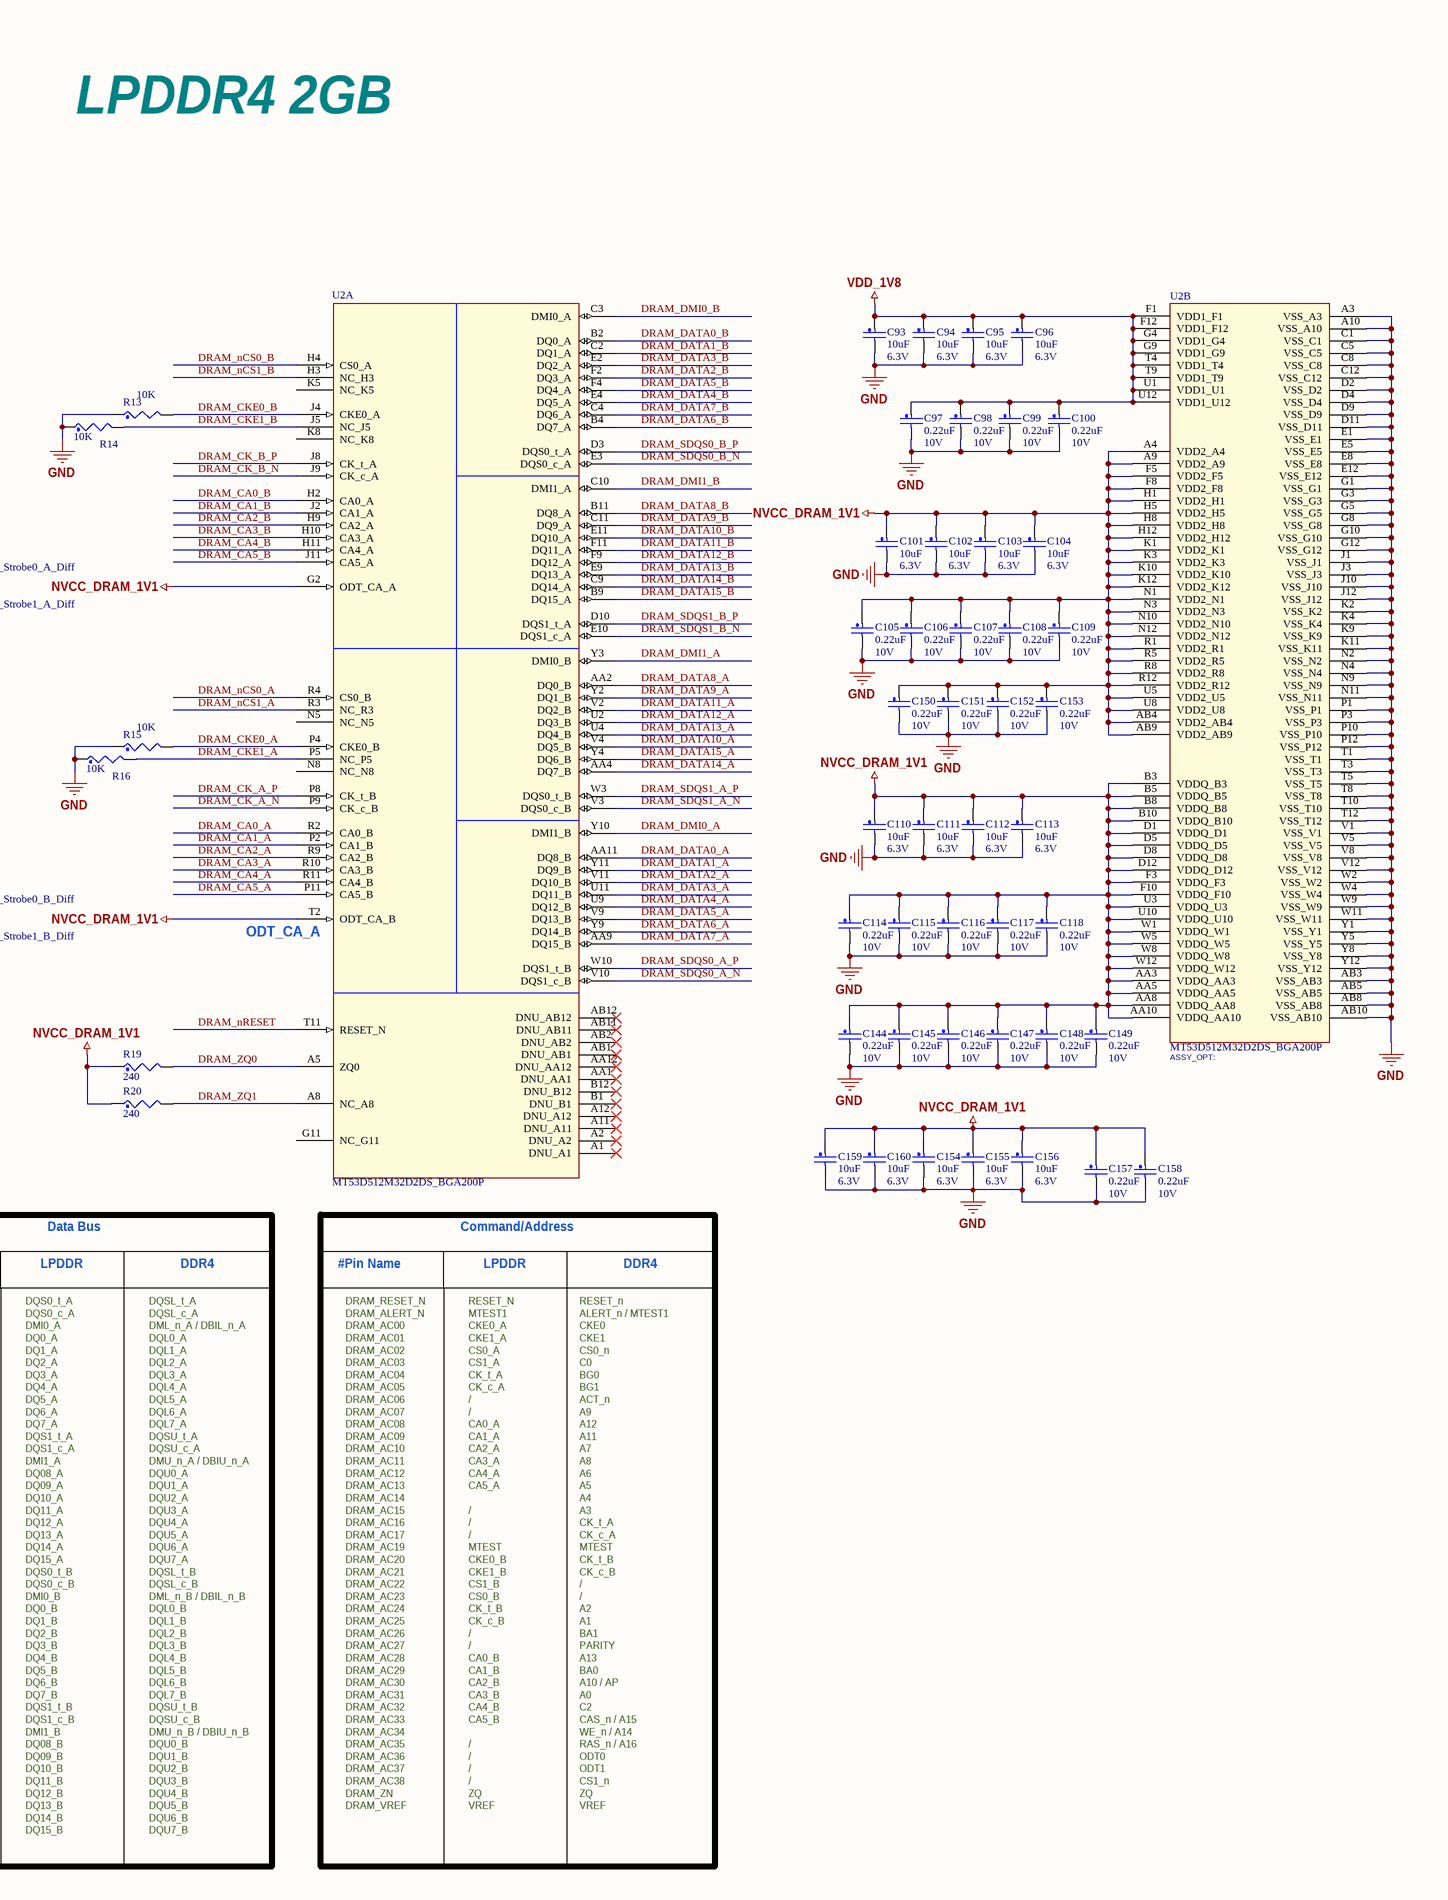
[diagram p3: P[06]_LPDDR4.SchDoc, right]

### Parts
C93  10uF  Voltage: 6.3V  [0402_CC - C]
C94  10uF  Voltage: 6.3V  [0402_CC - C]
C95  10uF  Voltage: 6.3V  [0402_CC - C]
C96  10uF  Voltage: 6.3V  [0402_CC - C]
C97  0.22uF  Voltage: 10V  [0201_CC - C]
C98  0.22uF  Voltage: 10V  [0201_CC - C]
C99  0.22uF  Voltage: 10V  [0201_CC - C]
C100  0.22uF  Voltage: 10V  [0201_CC - C]
C101  10uF  Voltage: 6.3V  [0402_CC - C]
C102  10uF  Voltage: 6.3V  [0402_CC - C]
C103  10uF  Voltage: 6.3V  [0402_CC - C]
C104  10uF  Voltage: 6.3V  [0402_CC - C]
C105  0.22uF  Voltage: 10V  [0201_CC - C]
C106  0.22uF  Voltage: 10V  [0201_CC - C]
C107  0.22uF  Voltage: 10V  [0201_CC - C]
C108  0.22uF  Voltage: 10V  [0201_CC - C]
C109  0.22uF  Voltage: 10V  [0201_CC - C]
C110  10uF  Voltage: 6.3V  [0402_CC - C]
C111  10uF  Voltage: 6.3V  [0402_CC - C]
C112  10uF  Voltage: 6.3V  [0402_CC - C]
C113  10uF  Voltage: 6.3V  [0402_CC - C]
C114  0.22uF  Voltage: 10V  [0201_CC - C]
C115  0.22uF  Voltage: 10V  [0201_CC - C]
C116  0.22uF  Voltage: 10V  [0201_CC - C]
C117  0.22uF  Voltage: 10V  [0201_CC - C]
C118  0.22uF  Voltage: 10V  [0201_CC - C]
C144  0.22uF  Voltage: 10V  [0201_CC - C]
C145  0.22uF  Voltage: 10V  [0201_CC - C]
C146  0.22uF  Voltage: 10V  [0201_CC - C]
C147  0.22uF  Voltage: 10V  [0201_CC - C]
C148  0.22uF  Voltage: 10V  [0201_CC - C]
C149  0.22uF  Voltage: 10V  [0201_CC - C]
C150  0.22uF  Voltage: 10V  [0201_CC - C]
C151  0.22uF  Voltage: 10V  [0201_CC - C]
C152  0.22uF  Voltage: 10V  [0201_CC - C]
C153  0.22uF  Voltage: 10V  [0201_CC - C]
C154  10uF  Voltage: 6.3V  [0402_CC - C]
C155  10uF  Voltage: 6.3V  [0402_CC - C]
C156  10uF  Voltage: 6.3V  [0402_CC - C]
C157  0.22uF  Voltage: 10V  [0201_CC - C]
C158  0.22uF  Voltage: 10V  [0201_CC - C]
C159  10uF  Voltage: 6.3V  [0402_CC - C]
C160  10uF  Voltage: 6.3V  [0402_CC - C]
R13  10K  [0201_CC]
R14  10K  [0201_CC]
R15  10K  [0201_CC]
R16  10K  [0201_CC]
R17  10K  [0201_CC]
R18  240  [0201_CC]
R19  240  [0201_CC]
R20  240  [0201_CC]
R21  150  [0402_CC]
R22  150  [0402_CC]
U1  (no value)  [BGA486_0P5_14X14]  (part A of 14)
U2  MT53D512M32D2DS_BGA200P  [BGA200_0P65X0P8_10P1X14P6]  (parts A,B of 2)

### Nets
GND: C93.2 C94.2 C95.2 C96.2 C97.2 C98.2 C99.2 C100.2 C101.2 C102.2 C103.2 C104.2 C105.2 C106.2 C107.2 C108.2 C109.2 C110.2 C111.2 C112.2 C113.2 C114.2 C115.2 C116.2 C117.2 C118.2 C144.2 C145.2 C146.2 C147.2 C148.2 C149.2 C150.2 C151.2 C152.2 C153.2 C154.2 C155.2 C156.2 C157.2 C158.2 C159.2 C160.2 R13.1 R14.1 R15.1 R16.1 R17.1 R18.1 U2.A3(VSS_A3) U2.A10(VSS_A10) U2.AB3(VSS_AB3) U2.AB5(VSS_AB5) U2.AB8(VSS_AB8) U2.AB10(VSS_AB10) U2.C1(VSS_C1) U2.C5(VSS_C5) U2.C8(VSS_C8) U2.C12(VSS_C12) U2.D2(VSS_D2) U2.D4(VSS_D4) U2.D9(VSS_D9) U2.D11(VSS_D11) U2.E1(VSS_E1) U2.E5(VSS_E5) U2.E8(VSS_E8) U2.E12(VSS_E12) U2.G1(VSS_G1) U2.G3(VSS_G3) U2.G5(VSS_G5) U2.G8(VSS_G8) U2.G10(VSS_G10) U2.G12(VSS_G12) U2.J1(VSS_J1) U2.J3(VSS_J3) U2.J10(VSS_J10) U2.J12(VSS_J12) U2.K2(VSS_K2) U2.K4(VSS_K4) U2.K9(VSS_K9) U2.K11(VSS_K11) U2.N2(VSS_N2) U2.N4(VSS_N4) U2.N9(VSS_N9) U2.N11(VSS_N11) U2.P1(VSS_P1) U2.P3(VSS_P3) U2.P10(VSS_P10) U2.P12(VSS_P12) U2.T1(VSS_T1) U2.T3(VSS_T3) U2.T5(VSS_T5) U2.T8(VSS_T8) U2.T10(VSS_T10) U2.T12(VSS_T12) U2.V1(VSS_V1) U2.V5(VSS_V5) U2.V8(VSS_V8) U2.V12(VSS_V12) U2.W2(VSS_W2) U2.W4(VSS_W4) U2.W9(VSS_W9) U2.W11(VSS_W11) U2.Y1(VSS_Y1) U2.Y5(VSS_Y5) U2.Y8(VSS_Y8) U2.Y12(VSS_Y12)
NVCC_DRAM_1V1: C101.1 C102.1 C103.1 C104.1 C105.1 C106.1 C107.1 C108.1 C109.1 C110.1 C111.1 C112.1 C113.1 C114.1 C115.1 C116.1 C117.1 C118.1 C144.1 C145.1 C146.1 C147.1 C148.1 C149.1 C150.1 C151.1 C152.1 C153.1 C154.1 C155.1 C156.1 C157.1 C158.1 C159.1 C160.1 R19.1 R20.1 U2.A4(VDD2_A4) U2.A9(VDD2_A9) U2.AA3(VDDQ_AA3) U2.AA5(VDDQ_AA5) U2.AA8(VDDQ_AA8) U2.AA10(VDDQ_AA10) U2.AB4(VDD2_AB4) U2.AB9(VDD2_AB9) U2.B3(VDDQ_B3) U2.B5(VDDQ_B5) U2.B8(VDDQ_B8) U2.B10(VDDQ_B10) U2.D1(VDDQ_D1) U2.D5(VDDQ_D5) U2.D8(VDDQ_D8) U2.D12(VDDQ_D12) U2.F3(VDDQ_F3) U2.F5(VDD2_F5) U2.F8(VDD2_F8) U2.F10(VDDQ_F10) U2.G2(ODT_CA_A) U2.H1(VDD2_H1) U2.H5(VDD2_H5) U2.H8(VDD2_H8) U2.H12(VDD2_H12) U2.K1(VDD2_K1) U2.K3(VDD2_K3) U2.K10(VDD2_K10) U2.K12(VDD2_K12) U2.N1(VDD2_N1) U2.N3(VDD2_N3) U2.N10(VDD2_N10) U2.N12(VDD2_N12) U2.R1(VDD2_R1) U2.R5(VDD2_R5) U2.R8(VDD2_R8) U2.R12(VDD2_R12) U2.T2(ODT_CA_B) U2.U3(VDDQ_U3) U2.U5(VDD2_U5) U2.U8(VDD2_U8) U2.U10(VDDQ_U10) U2.W1(VDDQ_W1) U2.W5(VDDQ_W5) U2.W8(VDDQ_W8) U2.W12(VDDQ_W12)
VDD_1V8: C93.1 C94.1 C95.1 C96.1 C97.1 C98.1 C99.1 C100.1 U2.F1(VDD1_F1) U2.F12(VDD1_F12) U2.G4(VDD1_G4) U2.G9(VDD1_G9) U2.T4(VDD1_T4) U2.T9(VDD1_T9) U2.U1(VDD1_U1) U2.U12(VDD1_U12)
DRAM_CA0_A: U1.J6(DRAM_AC08/CA0_A_/_A12_/_A12(BC#)) U2.R2(CA0_B)
DRAM_CA0_B: U1.W6(DRAM_AC28/CA0_B_/_A13_/_A13) U2.H2(CA0_A)
DRAM_CA1_A: U1.K6(DRAM_AC09/CA1_A_/_A11_/_A11) U2.P2(CA1_B)
DRAM_CA1_B: U1.V6(DRAM_AC29/CA1_B_/_BA0_/_BA0) U2.J2(CA1_A)
DRAM_CA2_A: U1.E4(DRAM_AC10/CA2_A_/_A7_/_A7) U2.R9(CA2_B)
DRAM_CA2_B: U1.AC4(DRAM_AC30/CA2_B_/_A10(AP)_/_A10(AP)) U2.H9(CA2_A)
DRAM_CA3_A: U1.D5(DRAM_AC11/CA3_A_/_A8_/_A8) U2.R10(CA3_B)
DRAM_CA3_B: U1.AD5(DRAM_AC31/CA3_B_/_A0_/_A0) U2.H10(CA3_A)
DRAM_CA4_A: U1.N4(DRAM_AC12/CA4_A_/_A6_/_A6) U2.R11(CA4_B)
DRAM_CA4_B: U1.R4(DRAM_AC32/CA4_B_/_C2_/_--) U2.H11(CA4_A)
DRAM_CA5_A: U1.N5(DRAM_AC13/CA5_A_/_A5_/_A5) U2.P11(CA5_B)
DRAM_CA5_B: U1.R5(DRAM_AC33/CA5_B/CAS_n(A15)/CAS#) U2.J11(CA5_A)
DRAM_CK_A_N: R21.2 U1.L1(DRAM_AC05/CK_c_A_/_BG1_/_A14) U2.P9(CK_c_B)
DRAM_CK_A_P: R21.1 U1.L2(DRAM_AC04/CK_t_A_/_BG0_/_BA2) U2.P8(CK_t_B)
DRAM_CK_B_N: R22.2 U1.U1(DRAM_AC25/CK_c_B_/_A1_/_A1) U2.J9(CK_c_A)
DRAM_CK_B_P: R22.1 U1.U2(DRAM_AC24/CK_t_B_/_A2_/_A2) U2.J8(CK_t_A)
DRAM_CKE0_A: R15.2 U1.F4(DRAM_AC00/CKE0_A_/_CKE0_/_CKE0) U2.P4(CKE0_B)
DRAM_CKE0_B: R13.2 U1.AB4(DRAM_AC20/CKE0_B_/_CK_t_B_/_CK_B) U2.J4(CKE0_A)
DRAM_CKE1_A: R16.2 U1.F5(DRAM_AC01/CKE1_A_/_CKE1_/_CKE1) U2.P5(NC_P5)
DRAM_CKE1_B: R14.2 U1.AB5(DRAM_AC21/CKE1_B_/_CK_c_B_/_CK#_B) U2.J5(NC_J5)
DRAM_DATA0_A: U1.A5(DRAM_DQ00) U2.AA11(DQ8_B)
DRAM_DATA0_B: U1.AB2(DRAM_DQ16) U2.B2(DQ0_A)
DRAM_DATA1_A: U1.B5(DRAM_DQ01) U2.Y11(DQ9_B)
DRAM_DATA1_B: U1.AA2(DRAM_DQ17) U2.C2(DQ1_A)
DRAM_DATA2_A: U1.D2(DRAM_DQ02) U2.V11(DQ10_B)
DRAM_DATA2_B: U1.W1(DRAM_DQ18) U2.F2(DQ3_A)
DRAM_DATA3_A: U1.D1(DRAM_DQ03) U2.U11(DQ11_B)
DRAM_DATA3_B: U1.W2(DRAM_DQ19) U2.E2(DQ2_A)
DRAM_DATA4_A: U1.C1(DRAM_DQ04) U2.U9(DQ12_B)
DRAM_DATA4_B: U1.V2(DRAM_DQ20) U2.E4(DQ5_A)
DRAM_DATA5_A: U1.B1(DRAM_DQ05) U2.V9(DQ13_B)
DRAM_DATA5_B: U1.V1(DRAM_DQ21) U2.F4(DQ4_A)
DRAM_DATA6_A: U1.A3(DRAM_DQ06) U2.Y9(DQ14_B)
DRAM_DATA6_B: U1.AC1(DRAM_DQ22) U2.B4(DQ7_A)
DRAM_DATA7_A: U1.B4(DRAM_DQ07) U2.AA9(DQ15_B)
DRAM_DATA7_B: U1.AC2(DRAM_DQ23) U2.C4(DQ6_A)
DRAM_DATA8_A: U1.F2(DRAM_DQ08) U2.AA2(DQ0_B)
DRAM_DATA8_B: U1.AG5(DRAM_DQ24) U2.B11(DQ8_A)
DRAM_DATA9_A: U1.G2(DRAM_DQ09) U2.Y2(DQ1_B)
DRAM_DATA9_B: U1.AF5(DRAM_DQ25) U2.C11(DQ9_A)
DRAM_DATA10_A: U1.J1(DRAM_DQ10) U2.V4(DQ5_B)
DRAM_DATA10_B: U1.AD2(DRAM_DQ26) U2.E11(DQ10_A)
DRAM_DATA11_A: U1.J2(DRAM_DQ11) U2.V2(DQ2_B)
DRAM_DATA11_B: U1.AD1(DRAM_DQ27) U2.F11(DQ11_A)
DRAM_DATA12_A: U1.K2(DRAM_DQ12) U2.U2(DQ3_B)
DRAM_DATA12_B: U1.AE1(DRAM_DQ28) U2.F9(DQ12_A)
DRAM_DATA13_A: U1.K1(DRAM_DQ13) U2.U4(DQ4_B)
DRAM_DATA13_B: U1.AF1(DRAM_DQ29) U2.E9(DQ13_A)
DRAM_DATA14_A: U1.E1(DRAM_DQ14) U2.AA4(DQ7_B)
DRAM_DATA14_B: U1.AG3(DRAM_DQ30) U2.C9(DQ14_A)
DRAM_DATA15_A: U1.E2(DRAM_DQ15) U2.Y4(DQ6_B)
DRAM_DATA15_B: U1.AF4(DRAM_DQ31) U2.B9(DQ15_A)
DRAM_DMI0_A: U1.A4(DRAM_DM0) U2.Y10(DMI1_B)
DRAM_DMI0_B: U1.AB1(DRAM_DM2) U2.C3(DMI0_A)
DRAM_DMI1_A: U1.F1(DRAM_DM1) U2.Y3(DMI0_B)
DRAM_DMI1_B: U1.AG4(DRAM_DM3) U2.C10(DMI1_A)
DRAM_nCS0_A: U1.K4(DRAM_AC02/CS0_A_/_CS0_n_/_CS0#) U2.R4(CS0_B)
DRAM_nCS0_B: U1.V4(DRAM_AC23/CS0_B_/_--_/_--) U2.H4(CS0_A)
DRAM_nCS1_A: U1.J4(DRAM_AC03/CS1_A_/_C0_/_--) U2.R3(NC_R3)
DRAM_nCS1_B: U1.W4(DRAM_AC22/CS1_B_/_--_/_--) U2.H3(NC_H3)
DRAM_nRESET: R17.2 U1.R1(RESET_n_/_RESET_n_/_RESET#) U2.T11(RESET_N)
DRAM_SDQS0_A_N: U1.B2(DRAM_DQS0_N) U2.V10(DQS1_c_B)
DRAM_SDQS0_A_P: U1.A2(DRAM_DQS0_P) U2.W10(DQS1_t_B)
DRAM_SDQS0_B_N: U1.Y1(DRAM_DQS2_N) U2.E3(DQS0_c_A)
DRAM_SDQS0_B_P: U1.AA1(DRAM_DQS2_P) U2.D3(DQS0_t_A)
DRAM_SDQS1_A_N: U1.H1(DRAM_DQS1_N) U2.V3(DQS0_c_B)
DRAM_SDQS1_A_P: U1.G1(DRAM_DQS1_P) U2.W3(DQS0_t_B)
DRAM_SDQS1_B_N: U1.AF2(DRAM_DQS3_N) U2.E10(DQS1_c_A)
DRAM_SDQS1_B_P: U1.AG2(DRAM_DQS3_P) U2.D10(DQS1_t_A)
DRAM_VREF: U1.P1(VREF_/_VREF_/_VREF)
DRAM_ZQ0: R19.2 U2.A5(ZQ0)
DRAM_ZQ1: R20.2 U2.A8(NC_A8)
NetR18_2: R18.2 U1.P2(DRAM_ZN)

Not connected (* = marked no-connect by the designer): U1 AB6(DRAM_AC38/--_/_CS1_n_/_CS1#) F6(DRAM_AC06/--_/_ACT_n_/_A15) J5(DRAM_AC07/--_/_A9_/_A9) K5(DRAM_AC14/_--_/_A4_/_A4)* M1(DRAM_AC16/--_/_CK_t_A_/_CK_A) M2(DRAM_AC17/--_/_CK_c_A_/_CK#_A) N1(DRAM_AC26/--_/_BA1_/_BA1) N2(DRAM_AC19/MTEST_/_MTEST_/_MTEST) N6(DRAM_AC15/--_/_A3_/_A3) R2(DRAM_ALERT_N)* R6(DRAM_AC27/--_/_PARITY_/_--) T1(DRAM_AC34/_--_/WE_n(A14)/WE#)* T2(DRAM_AC35/--_/_RAS_n(A16)_/_RAS#) V5(DRAM_AC36/--_/_ODT0_/_ODT0) W5(DRAM_AC37/--_/_ODT1_/_ODT1); U2 A1(DNU_A1)* A2(DNU_A2)* A11(DNU_A11)* A12(DNU_A12)* AA1(DNU_AA1)* AA12(DNU_AA12)* AB1(DNU_AB1)* AB2(DNU_AB2)* AB11(DNU_AB11)* AB12(DNU_AB12)* B1(DNU_B1)* B12(DNU_B12)* G11(NC_G11) K5(NC_K5) K8(NC_K8) N5(NC_N5) N8(NC_N8)

### Layout directives
differential pair; differential pair class DRAM_Strobe0_A_Diff: DRAM_SDQS0_A_P
differential pair: DRAM_CK_A_N, DRAM_CK_B_N, DRAM_SDQS0_A_N, DRAM_SDQS0_B_N, DRAM_SDQS1_A_N, DRAM_SDQS1_B_N
differential pair; differential pair class DRAM_Strobe1_A_Diff: DRAM_SDQS1_A_P
differential pair; differential pair class DRAM_Strobe0_B_Diff: DRAM_SDQS0_B_P
differential pair; differential pair class DRAM_Strobe1_B_Diff: DRAM_SDQS1_B_P
differential pair; differential pair class DDR_CK_B_Diff: DRAM_CK_B_P
differential pair; differential pair class DDR_CK_A_Diff: DRAM_CK_A_P

### Notes on the sheet
- LPDDR4 2GB
- (near U2) ODT_CA_A
- #TP
- Data Bus
- Command/Address
- #Pin Name
- LPDDR
- DDR4
- (near R21) #DDR Diff CLK Termination CH A
- (near R22) #DDR Diff CLK Termination CH B
- DRAM_DQS0_P
  DRAM_DQS0_N
  DRAM_DM0
  DRAM_DQ00
  DRAM_DQ01
  DRAM_DQ02
  DRAM_DQ03
  DRAM_DQ04
  DRAM_DQ05
  DRAM_DQ06
  DRAM_DQ07
  DRAM_DQS1_P
  DRAM_DQS1_N
  DRAM_DM1
  DRAM_DQ08
  DRAM_DQ09
  DRAM_DQ10
  DRAM_DQ11
  DRAM_DQ12
  DRAM_DQ13
  DRAM_DQ14
  DRAM_DQ15
  DRAM_DQS2_P
  DRAM_DQS2_N
  DRAM_DM2
  DRAM_DQ16
  DRAM_DQ17
  DRAM_DQ18
  DRAM_DQ19
  DRAM_DQ20
  DRAM_DQ21
  DRAM_DQ22
  DRAM_DQ23
  DRAM_DQS3_P
  DRAM_DQS3_N
  DRAM_DM3
  DRAM_DQ24
  DRAM_DQ25
  DRAM_DQ26
  DRAM_DQ27
  DRAM_DQ28
  DRAM_DQ29
  DRAM_DQ30
  DRAM_DQ31
- DQS0_t_A
  DQS0_c_A
  DMI0_A
  DQ0_A
  DQ1_A
  DQ2_A
  DQ3_A
  DQ4_A
  DQ5_A
  DQ6_A
  DQ7_A
  DQS1_t_A
  DQS1_c_A
  DMI1_A
  DQ08_A
  DQ09_A
  DQ10_A
  DQ11_A
  DQ12_A
  DQ13_A
  DQ14_A
  DQ15_A
  DQS0_t_B
  DQS0_c_B
  DMI0_B
  DQ0_B
  DQ1_B
  DQ2_B
  DQ3_B
  DQ4_B
  DQ5_B
  DQ6_B
  DQ7_B
  DQS1_t_B
  DQS1_c_B
  DMI1_B
  DQ08_B
  DQ09_B
  DQ10_B
  DQ11_B
  DQ12_B
  DQ13_B
  DQ14_B
  DQ15_B
- DQSL_t_A
  DQSL_c_A
  DML_n_A / DBIL_n_A
  DQL0_A
  DQL1_A
  DQL2_A
  DQL3_A
  DQL4_A
  DQL5_A
  DQL6_A
  DQL7_A
  DQSU_t_A
  DQSU_c_A
  DMU_n_A / DBIU_n_A
  DQU0_A
  DQU1_A
  DQU2_A
  DQU3_A
  DQU4_A
  DQU5_A
  DQU6_A
  DQU7_A
  DQSL_t_B
  DQSL_c_B
  DML_n_B / DBIL_n_B
  DQL0_B
  DQL1_B
  DQL2_B
  DQL3_B
  DQL4_B
  DQL5_B
  DQL6_B
  DQL7_B
  DQSU_t_B
  DQSU_c_B
  DMU_n_B / DBIU_n_B
  DQU0_B
  DQU1_B
  DQU2_B
  DQU3_B
  DQU4_B
  DQU5_B
  DQU6_B
  DQU7_B
- DRAM_RESET_N
  DRAM_ALERT_N
  DRAM_AC00
  DRAM_AC01
  DRAM_AC02
  DRAM_AC03
  DRAM_AC04
  DRAM_AC05
  DRAM_AC06
  DRAM_AC07
  DRAM_AC08
  DRAM_AC09
  DRAM_AC10
  DRAM_AC11
  DRAM_AC12
  DRAM_AC13
  DRAM_AC14
  DRAM_AC15
  DRAM_AC16
  DRAM_AC17
  DRAM_AC19
  DRAM_AC20
  DRAM_AC21
  DRAM_AC22
  DRAM_AC23
  DRAM_AC24
  DRAM_AC25
  DRAM_AC26
  DRAM_AC27
  DRAM_AC28
  DRAM_AC29
  DRAM_AC30
  DRAM_AC31
  DRAM_AC32
  DRAM_AC33
  DRAM_AC34
  DRAM_AC35
  DRAM_AC36
  DRAM_AC37
  DRAM_AC38
  DRAM_ZN
  DRAM_VREF
- RESET_N
  MTEST1
  CKE0_A
  CKE1_A
  CS0_A
  CS1_A
  CK_t_A
  CK_c_A
  /
  /
  CA0_A
  CA1_A
  CA2_A
  CA3_A
  CA4_A
  CA5_A
  /
  /
  /
  MTEST
  CKE0_B
  CKE1_B
  CS1_B
  CS0_B
  CK_t_B
  CK_c_B
  /
  /
  CA0_B
  CA1_B
  CA2_B
  CA3_B
  CA4_B
  CA5_B
  /
  /
  /
  /
  ZQ
  VREF
- RESET_n
  ALERT_n / MTEST1
  CKE0
  CKE1
  CS0_n
  C0
  BG0
  BG1
  ACT_n
  A9
  A12
  A11
  A7
  A8
  A6
  A5
  A4
  A3
  CK_t_A
  CK_c_A
  MTEST
  CK_t_B
  CK_c_B
  /
  /
  A2
  A1
  BA1
  PARITY
  A13
  BA0
  A10 / AP
  A0
  C2
  CAS_n / A15
  WE_n / A14
  RAS_n / A16
  ODT0
  ODT1
  CS1_n
  ZQ
  VREF
- (in symbol MIMX8MM_BGA486P, part A) i.MX8M Mini - DDR; PAD/(LPDDR4/DDR4/DDR3)

### Library data of the parts
C93-C118 C144-C160 = CAP_NP: CLASS: DISCRETE
R13-R22 = RES: CLASS: DISCRETE
U1 = MIMX8MM_BGA486P: as U1 on sheet P[04]_CPU_POWER; CLASS: IC; HEIGHT: 1.25MM; ROHS: Yes
U2 = MT53D512M32D2DS_BGA200P: MT53D512M32D2DS_BGA200P\By AAR; SWAP_INFO: (S1+S2); SPLIT_INST: TRUE; CLASS: IC

## Sheet P[07]_CPU_PHY.SchDoc
size 386 x 246 mm
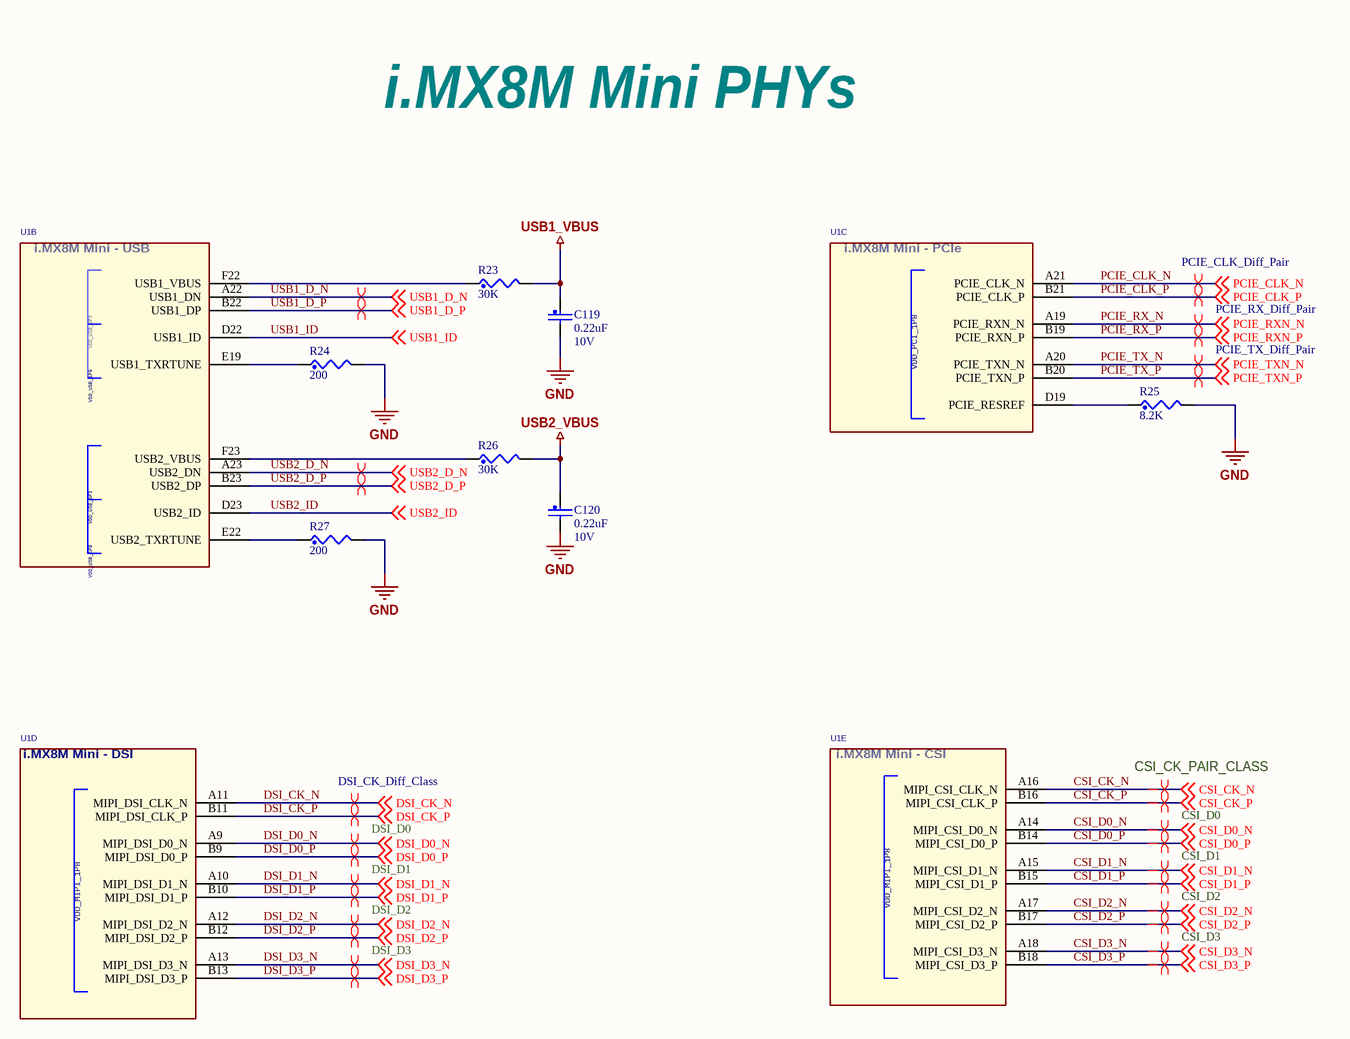
[diagram p4: P[07]_CPU_PHY.SchDoc]

### Parts
C119  0.22uF  Voltage: 10V  [0201_CC - C]
C120  0.22uF  Voltage: 10V  [0201_CC - C]
R23  30K  [0201_CC]
R24  200  [0201_CC]
R25  8.2K  [0402_CC]
R26  30K  [0201_CC]
R27  200  [0201_CC]
U1  (no value)  [BGA486_0P5_14X14]  (parts B,C,D,E of 14)

### Nets
GND: C119.2 C120.2 R24.2 R25.2 R27.2
USB1_VBUS: C119.1 R23.2
USB2_VBUS: C120.1 R26.2
CSI_CK_N: U1.A16(MIPI_CSI_CLK_N) ; off-sheet CSI_CK_N
CSI_CK_P: U1.B16(MIPI_CSI_CLK_P) ; off-sheet CSI_CK_P
CSI_D0_N: U1.A14(MIPI_CSI_D0_N) ; off-sheet CSI_D0_N
CSI_D0_P: U1.B14(MIPI_CSI_D0_P) ; off-sheet CSI_D0_P
CSI_D1_N: U1.A15(MIPI_CSI_D1_N) ; off-sheet CSI_D1_N
CSI_D1_P: U1.B15(MIPI_CSI_D1_P) ; off-sheet CSI_D1_P
CSI_D2_N: U1.A17(MIPI_CSI_D2_N) ; off-sheet CSI_D2_N
CSI_D2_P: U1.B17(MIPI_CSI_D2_P) ; off-sheet CSI_D2_P
CSI_D3_N: U1.A18(MIPI_CSI_D3_N) ; off-sheet CSI_D3_N
CSI_D3_P: U1.B18(MIPI_CSI_D3_P) ; off-sheet CSI_D3_P
DSI_CK_N: U1.A11(MIPI_DSI_CLK_N) ; off-sheet DSI_CK_N
DSI_CK_P: U1.B11(MIPI_DSI_CLK_P) ; off-sheet DSI_CK_P
DSI_D0_N: U1.A9(MIPI_DSI_D0_N) ; off-sheet DSI_D0_N
DSI_D0_P: U1.B9(MIPI_DSI_D0_P) ; off-sheet DSI_D0_P
DSI_D1_N: U1.A10(MIPI_DSI_D1_N) ; off-sheet DSI_D1_N
DSI_D1_P: U1.B10(MIPI_DSI_D1_P) ; off-sheet DSI_D1_P
DSI_D2_N: U1.A12(MIPI_DSI_D2_N) ; off-sheet DSI_D2_N
DSI_D2_P: U1.B12(MIPI_DSI_D2_P) ; off-sheet DSI_D2_P
DSI_D3_N: U1.A13(MIPI_DSI_D3_N) ; off-sheet DSI_D3_N
DSI_D3_P: U1.B13(MIPI_DSI_D3_P) ; off-sheet DSI_D3_P
PCIE_CLK_N: U1.A21(PCIE_CLK_N) ; off-sheet PCIE_CLK_N
PCIE_CLK_P: U1.B21(PCIE_CLK_P) ; off-sheet PCIE_CLK_P
PCIE_RX_N: U1.A19(PCIE_RXN_N) ; off-sheet PCIE_RXN_N  [also labelled PCIE_RXN_N]
PCIE_RX_P: U1.B19(PCIE_RXN_P) ; off-sheet PCIE_RXN_P  [also labelled PCIE_RXN_P]
PCIE_TX_N: U1.A20(PCIE_TXN_N) ; off-sheet PCIE_TXN_N  [also labelled PCIE_TXN_N]
PCIE_TX_P: U1.B20(PCIE_TXN_P) ; off-sheet PCIE_TXN_P  [also labelled PCIE_TXN_P]
USB1_D_N: U1.A22(USB1_DN) ; off-sheet USB1_D_N
USB1_D_P: U1.B22(USB1_DP) ; off-sheet USB1_D_P
USB1_ID: U1.D22(USB1_ID) ; off-sheet USB1_ID
USB2_D_N: U1.A23(USB2_DN) ; off-sheet USB2_D_N
USB2_D_P: U1.B23(USB2_DP) ; off-sheet USB2_D_P
USB2_ID: U1.D23(USB2_ID) ; off-sheet USB2_ID
NetR23_1: R23.1 U1.F22(USB1_VBUS)
NetR24_1: R24.1 U1.E19(USB1_TXRTUNE)
NetR25_1: R25.1 U1.D19(PCIE_RESREF)
NetR26_1: R26.1 U1.F23(USB2_VBUS)
NetR27_1: R27.1 U1.E22(USB2_TXRTUNE)

### Layout directives
differential pair: CSI_CK_P, CSI_D0_P, CSI_D1_P, CSI_D2_P, CSI_D3_P, DSI_CK_P, DSI_D0_P, DSI_D1_P, DSI_D2_P, DSI_D3_P, PCIE_CLK_P, PCIE_RX_P, PCIE_TX_P, USB1_D_N, USB1_D_P, USB2_D_N, USB2_D_P
differential pair; differential pair class DSI_CK_Diff_Class: DSI_CK_N
differential pair; differential pair class DSI_D0: DSI_D0_N
differential pair; differential pair class DSI_D1: DSI_D1_N
differential pair; differential pair class DSI_D2: DSI_D2_N
differential pair; differential pair class DSI_D3: DSI_D3_N
differential pair; net class PCIE_TX_Diff_Pair: PCIE_TX_N
differential pair; differential pair class PCIE_RX_Diff_Pair: PCIE_RX_N
differential pair; differential pair class PCIE_CLK_Diff_Pair: PCIE_CLK_N
differential pair; differential pair class CSI_CK_PAIR_CLASS: CSI_CK_N
differential pair; differential pair class CSI_D0: CSI_D0_N
differential pair; differential pair class CSI_D1: CSI_D1_N
differential pair; differential pair class CSI_D2: CSI_D2_N
differential pair; differential pair class CSI_D3: CSI_D3_N

### Notes on the sheet
- i.MX8M Mini PHYs
- (in symbol MIMX8MM_BGA486P, part B) i.MX8M Mini - USB
- (in symbol MIMX8MM_BGA486P, part C) i.MX8M Mini - PCIe
- (in symbol MIMX8MM_BGA486P, part D) i.MX8M Mini - DSI
- (in symbol MIMX8MM_BGA486P, part E) i.MX8M Mini - CSI

### Library data of the parts
C119 C120 = CAP_NP: CLASS: DISCRETE
R23-R27 = RES: CLASS: DISCRETE
U1 = MIMX8MM_BGA486P: as U1 on sheet P[04]_CPU_POWER; CLASS: IC; HEIGHT: 1.25MM; ROHS: Yes

## Sheet P[08]_CPU_MISC.SchDoc
size A
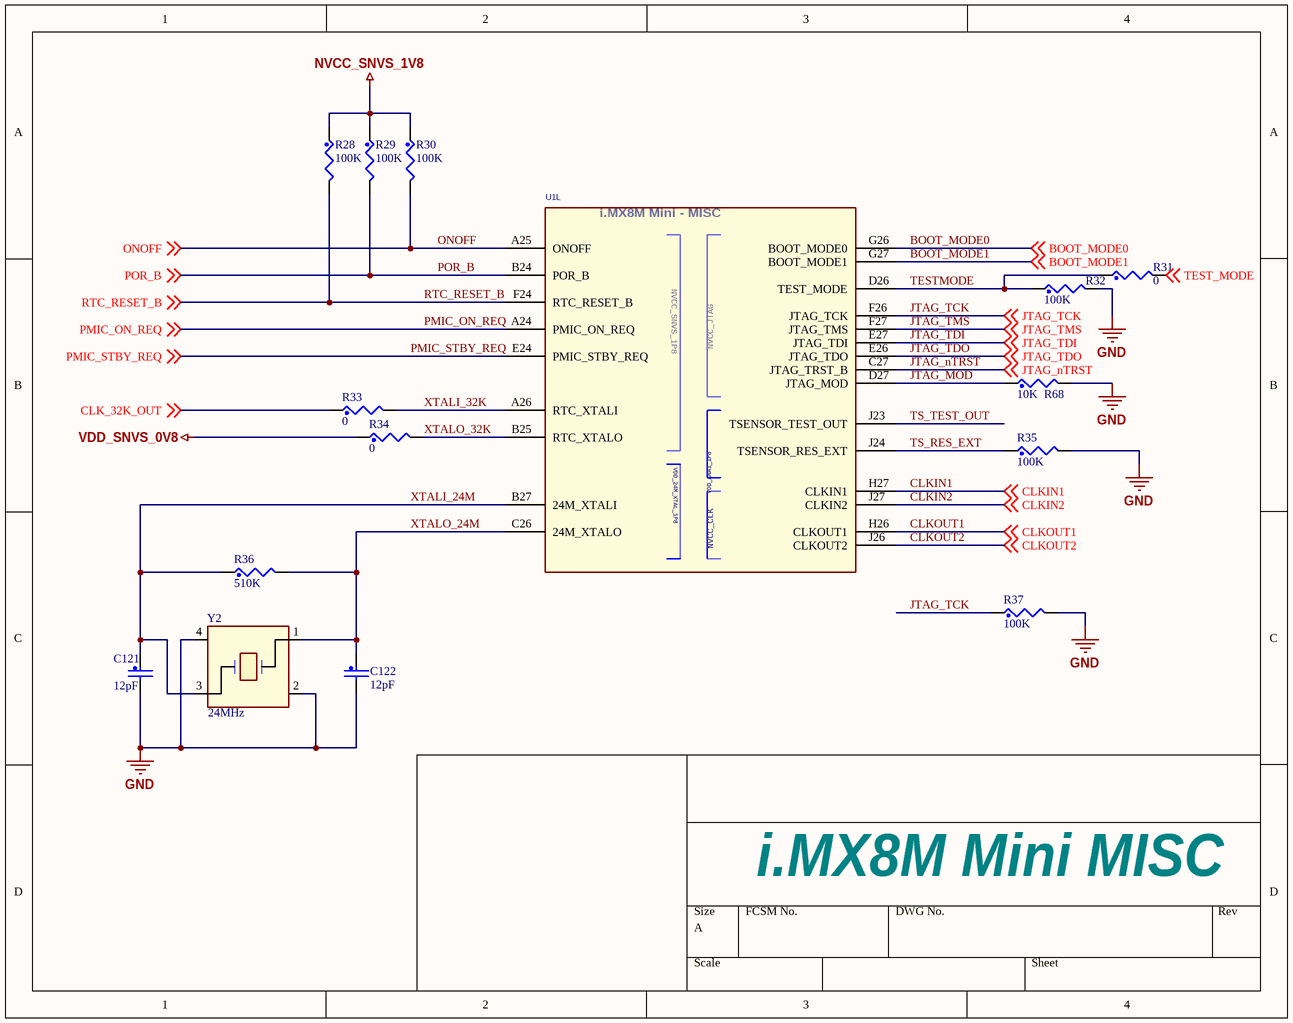
[diagram p5: P[08]_CPU_MISC.SchDoc]

### Parts
C121  12pF  [0201_CC - C]
C122  12pF  [0201_CC - C]
R28  100K  [0201_CC]
R29  100K  [0201_CC]
R30  100K  [0201_CC]
R31  0  [0402_CC]
R32  100K  [0201_CC]
R33  0  [0402_CC]
R34  0  [0402_CC]
R35  100K  [0201_CC]
R36  510K  [0402_CC]
R37  100K  [0201_CC]
R68  10K  [0201_CC]
U1  SFP_CGND  [BGA486_0P5_14X14]  (value not drawn)  (part L of 14)
Y2  24MHz  [OSCCC320X250X60]

### Nets
GND: C121.2 C122.2 R32.2 R35.2 R37.2 R68.2 Y2.2 Y2.4
NVCC_SNVS_1V8: R28.1 R29.1 R30.1
VDD_SNVS_0V8: R34.1
BOOT_MODE0: U1.G26(BOOT_MODE0) ; off-sheet BOOT_MODE0
BOOT_MODE1: U1.G27(BOOT_MODE1) ; off-sheet BOOT_MODE1
CLK_32K_OUT: R33.1 ; off-sheet CLK_32K_OUT
CLKIN1: U1.H27(CLKIN1) ; off-sheet CLKIN1
CLKIN2: U1.J27(CLKIN2) ; off-sheet CLKIN2
CLKOUT1: U1.H26(CLKOUT1) ; off-sheet CLKOUT1
CLKOUT2: U1.J26(CLKOUT2) ; off-sheet CLKOUT2
JTAG_MOD: R68.1 U1.D27(JTAG_MOD)
JTAG_nTRST: U1.C27(JTAG_TRST_B) ; off-sheet JTAG_nTRST  [project net JATAG_nTRST]
JTAG_TCK: R37.1 U1.F26(JTAG_TCK) ; off-sheet JTAG_TCK  [project net JATAG_TCK]
JTAG_TDI: U1.E27(JTAG_TDI) ; off-sheet JTAG_TDI  [project net JATAG_TDI]
JTAG_TDO: U1.E26(JTAG_TDO) ; off-sheet JTAG_TDO  [project net JATAG_TDO]
JTAG_TMS: U1.F27(JTAG_TMS) ; off-sheet JTAG_TMS  [project net JATAG_TMS]
ONOFF: R30.2 U1.A25(ONOFF) ; off-sheet ONOFF
PMIC_ON_REQ: U1.A24(PMIC_ON_REQ) ; off-sheet PMIC_ON_REQ
PMIC_STBY_REQ: U1.E24(PMIC_STBY_REQ) ; off-sheet PMIC_STBY_REQ
POR_B: R29.2 U1.B24(POR_B) ; off-sheet POR_B
RTC_RESET_B: R28.2 U1.F24(RTC_RESET_B) ; off-sheet RTC_RESET_B
TEST_MODE: R31.2 ; off-sheet TEST_MODE
TESTMODE: R31.1 R32.1 U1.D26(TEST_MODE)
TS_RES_EXT: R35.1 U1.J24(TSENSOR_RES_EXT)
TS_TEST_OUT: U1.J23(TSENSOR_TEST_OUT)
XTALI_24M: C121.1 R36.1 U1.B27(24M_XTALI) Y2.3
XTALI_32K: R33.2 U1.A26(RTC_XTALI)
XTALO_24M: C122.1 R36.2 U1.C26(24M_XTALO) Y2.1
XTALO_32K: R34.2 U1.B25(RTC_XTALO)

### Notes on the sheet
- i.MX8M Mini MISC
- (in symbol MIMX8MM_BGA486P, part L) i.MX8M Mini - MISC; VDD_ANA1_1P8

### Library data of the parts
C121 C122 = CAP_NP: CLASS: DISCRETE
R28-R37 R68 = RES: CLASS: DISCRETE
U1 = MIMX8MM_BGA486P: as U1 on sheet P[04]_CPU_POWER; CLASS: IC; HEIGHT: 1.25MM; ROHS: Yes
Y2 = XTAL_13Y: CLASS: IC

## Sheet P[09]_eMMC_QSPI.SchDoc
size A3
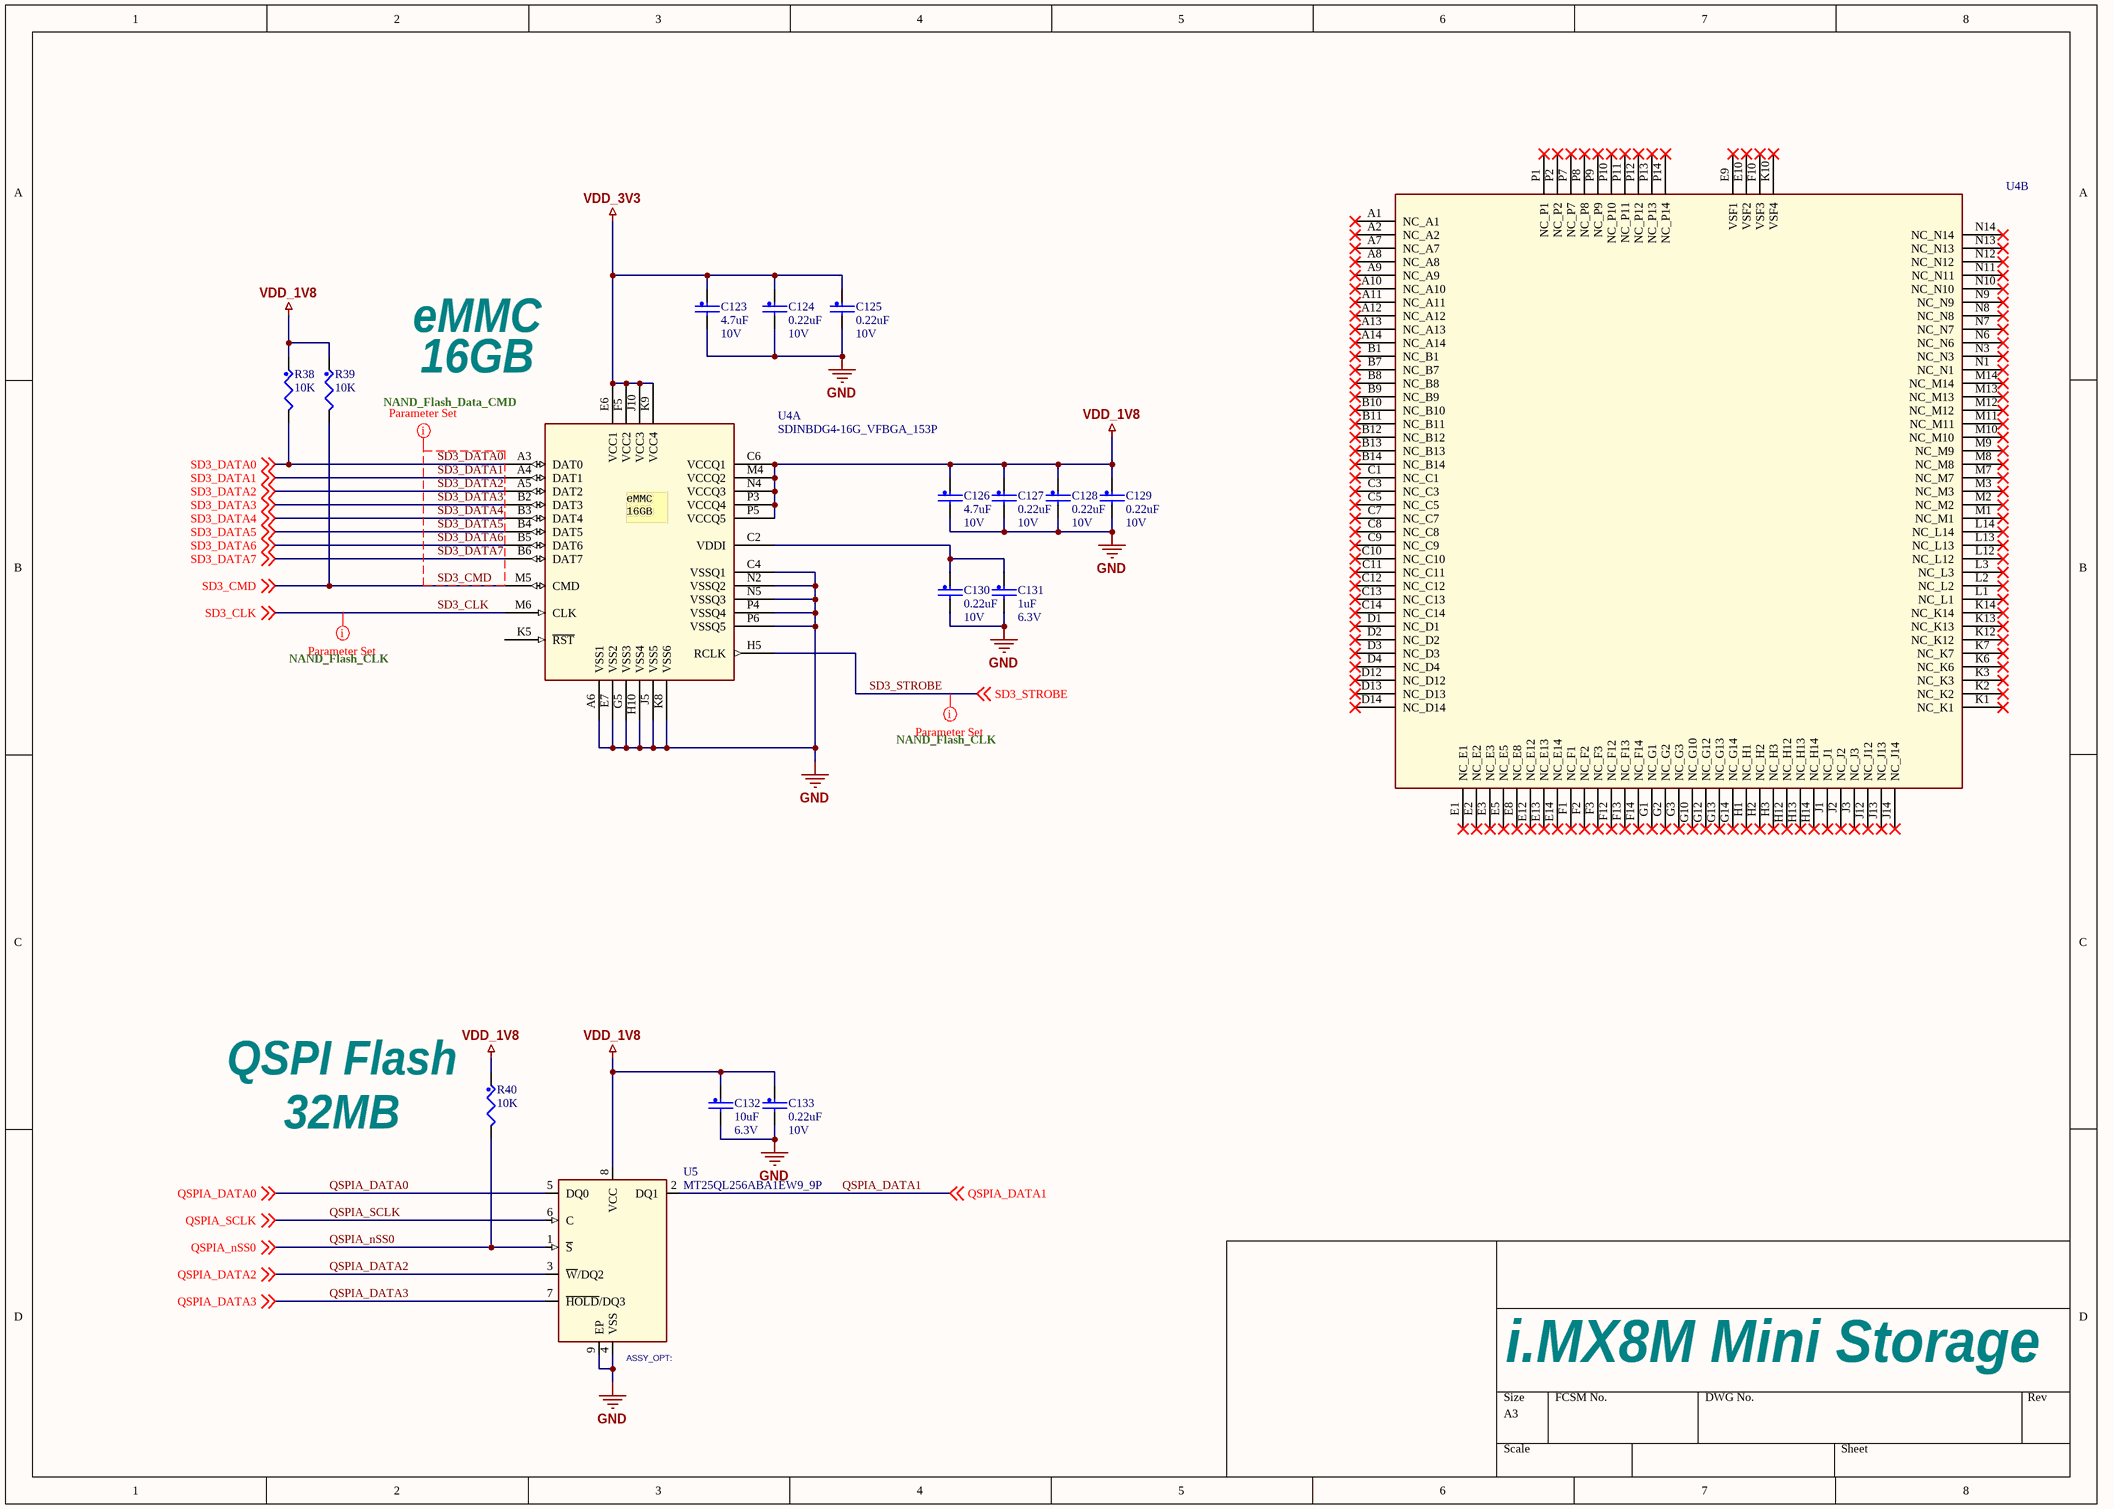
[diagram p6: P[09]_eMMC_QSPI.SchDoc]

### Parts
C123  4.7uF  Voltage: 10V  [0402_CC - C]
C124  0.22uF  Voltage: 10V  [0201_CC - C]
C125  0.22uF  Voltage: 10V  [0201_CC - C]
C126  4.7uF  Voltage: 10V  [0402_CC - C]
C127  0.22uF  Voltage: 10V  [0201_CC - C]
C128  0.22uF  Voltage: 10V  [0201_CC - C]
C129  0.22uF  Voltage: 10V  [0201_CC - C]
C130  0.22uF  Voltage: 10V  [0201_CC - C]
C131  1uF  Voltage: 6.3V  [0201_CC - C]
C132  10uF  Voltage: 6.3V  [0402_CC - C]
C133  0.22uF  Voltage: 10V  [0201_CC - C]
R38  10K  [0201_CC]
R39  10K  [0201_CC]
R40  10K  [0402_CC]
U4  SDINBDG4-16G_VFBGA_153P  [FBGA153_0P5_11P5X13]  (parts A,B of 2)
U5  MT25QL256ABA1EW9_9P  [DFN8_1P27_6X5MM_3P1]

### Nets
GND: C123.2 C124.2 C125.2 C126.2 C127.2 C128.2 C129.2 C130.2 C131.2 C132.2 C133.2 U4.A6(VSS1) U4.C4(VSSQ1) U4.E7(VSS2) U4.G5(VSS3) U4.H10(VSS4) U4.J5(VSS5) U4.K8(VSS6) U4.N2(VSSQ2) U4.N5(VSSQ3) U4.P4(VSSQ4) U4.P6(VSSQ5) U5.4(VSS) U5.9(EP)
VDD_1V8: C126.1 C127.1 C128.1 C129.1 C132.1 C133.1 R38.1 R39.1 R40.1 U4.C6(VCCQ1) U4.M4(VCCQ2) U4.N4(VCCQ3) U4.P3(VCCQ4) U4.P5(VCCQ5) U5.8(VCC)
VDD_3V3: C123.1 C124.1 C125.1 U4.E6(VCC1) U4.F5(VCC2) U4.J10(VCC3) U4.K9(VCC4)
QSPIA_DATA0: U5.5(DQ0) ; off-sheet QSPIA_DATA0
QSPIA_DATA1: U5.2(DQ1) ; off-sheet QSPIA_DATA1
QSPIA_DATA2: U5.3(~{W}/DQ2) ; off-sheet QSPIA_DATA2
QSPIA_DATA3: U5.7(~{HOLD}/DQ3) ; off-sheet QSPIA_DATA3
QSPIA_nSS0: R40.2 U5.1(~{S}) ; off-sheet QSPIA_nSS0
QSPIA_SCLK: U5.6(C) ; off-sheet QSPIA_SCLK
SD3_CLK: U4.M6(CLK) ; off-sheet SD3_CLK
SD3_CMD: R39.2 U4.M5(CMD) ; off-sheet SD3_CMD
SD3_DATA0: R38.2 U4.A3(DAT0) ; off-sheet SD3_DATA0
SD3_DATA1: U4.A4(DAT1) ; off-sheet SD3_DATA1
SD3_DATA2: U4.A5(DAT2) ; off-sheet SD3_DATA2
SD3_DATA3: U4.B2(DAT3) ; off-sheet SD3_DATA3
SD3_DATA4: U4.B3(DAT4) ; off-sheet SD3_DATA4
SD3_DATA5: U4.B4(DAT5) ; off-sheet SD3_DATA5
SD3_DATA6: U4.B5(DAT6) ; off-sheet SD3_DATA6
SD3_DATA7: U4.B6(DAT7) ; off-sheet SD3_DATA7
SD3_STROBE: U4.H5(RCLK) ; off-sheet SD3_STROBE
NetC130_1: C130.1 C131.1 U4.C2(VDDI)

Not connected (* = marked no-connect by the designer): U4 A1(NC_A1)* A2(NC_A2)* A7(NC_A7)* A8(NC_A8)* A9(NC_A9)* A10(NC_A10)* A11(NC_A11)* A12(NC_A12)* A13(NC_A13)* A14(NC_A14)* B1(NC_B1)* B7(NC_B7)* B8(NC_B8)* B9(NC_B9)* B10(NC_B10)* B11(NC_B11)* B12(NC_B12)* B13(NC_B13)* B14(NC_B14)* C1(NC_C1)* C3(NC_C3)* C5(NC_C5)* C7(NC_C7)* C8(NC_C8)* C9(NC_C9)* C10(NC_C10)* C11(NC_C11)* C12(NC_C12)* C13(NC_C13)* C14(NC_C14)* D1(NC_D1)* D2(NC_D2)* D3(NC_D3)* D4(NC_D4)* D12(NC_D12)* D13(NC_D13)* D14(NC_D14)* E1(NC_E1)* E2(NC_E2)* E3(NC_E3)* E5(NC_E5)* E8(NC_E8)* E9(VSF1)* E10(VSF2)* E12(NC_E12)* E13(NC_E13)* E14(NC_E14)* F1(NC_F1)* F2(NC_F2)* F3(NC_F3)* F10(VSF3)* F12(NC_F12)* F13(NC_F13)* F14(NC_F14)* G1(NC_G1)* G2(NC_G2)* G3(NC_G3)* G10(NC_G10)* G12(NC_G12)* G13(NC_G13)* G14(NC_G14)* H1(NC_H1)* H2(NC_H2)* H3(NC_H3)* H12(NC_H12)* H13(NC_H13)* H14(NC_H14)* J1(NC_J1)* J2(NC_J2)* J3(NC_J3)* J12(NC_J12)* J13(NC_J13)* J14(NC_J14)* K1(NC_K1)* K2(NC_K2)* K3(NC_K3)* K5(~{RST}) K6(NC_K6)* K7(NC_K7)* K10(VSF4)* K12(NC_K12)* K13(NC_K13)* K14(NC_K14)* L1(NC_L1)* L2(NC_L2)* L3(NC_L3)* L12(NC_L12)* L13(NC_L13)* L14(NC_L14)* M1(NC_M1)* M2(NC_M2)* M3(NC_M3)* M7(NC_M7)* M8(NC_M8)* M9(NC_M9)* M10(NC_M10)* M11(NC_M11)* M12(NC_M12)* M13(NC_M13)* M14(NC_M14)* N1(NC_N1)* N3(NC_N3)* N6(NC_N6)* N7(NC_N7)* N8(NC_N8)* N9(NC_N9)* N10(NC_N10)* N11(NC_N11)* N12(NC_N12)* N13(NC_N13)* N14(NC_N14)* P1(NC_P1)* P2(NC_P2)* P7(NC_P7)* P8(NC_P8)* P9(NC_P9)* P10(NC_P10)* P11(NC_P11)* P12(NC_P12)* P13(NC_P13)* P14(NC_P14)*

### Layout directives
net class NAND_Flash_Data_CMD: SD3_CMD, SD3_DATA0, SD3_DATA1, SD3_DATA2, SD3_DATA3, SD3_DATA4, SD3_DATA5, SD3_DATA6, SD3_DATA7
net class NAND_Flash_CLK: SD3_CLK, SD3_STROBE

### Notes on the sheet
- eMMC
- (near U4) 16GB
- (near R40) QSPI Flash
- 32MB
- i.MX8M Mini Storage
- (in symbol SDINBDG4-16G_VFBGA_153P, part A) eMMC / 16GB

### Library data of the parts
C123-C133 = CAP_NP: CLASS: DISCRETE
R38-R40 = RES: CLASS: DISCRETE
U4 = SDINBDG4-16G_VFBGA_153P: CLASS: IC
U5 = MT25QL256ABA1EW9_9P: CLASS: IC

## Sheet P[10]WIFI_Bluetooth.SchDoc
size A3
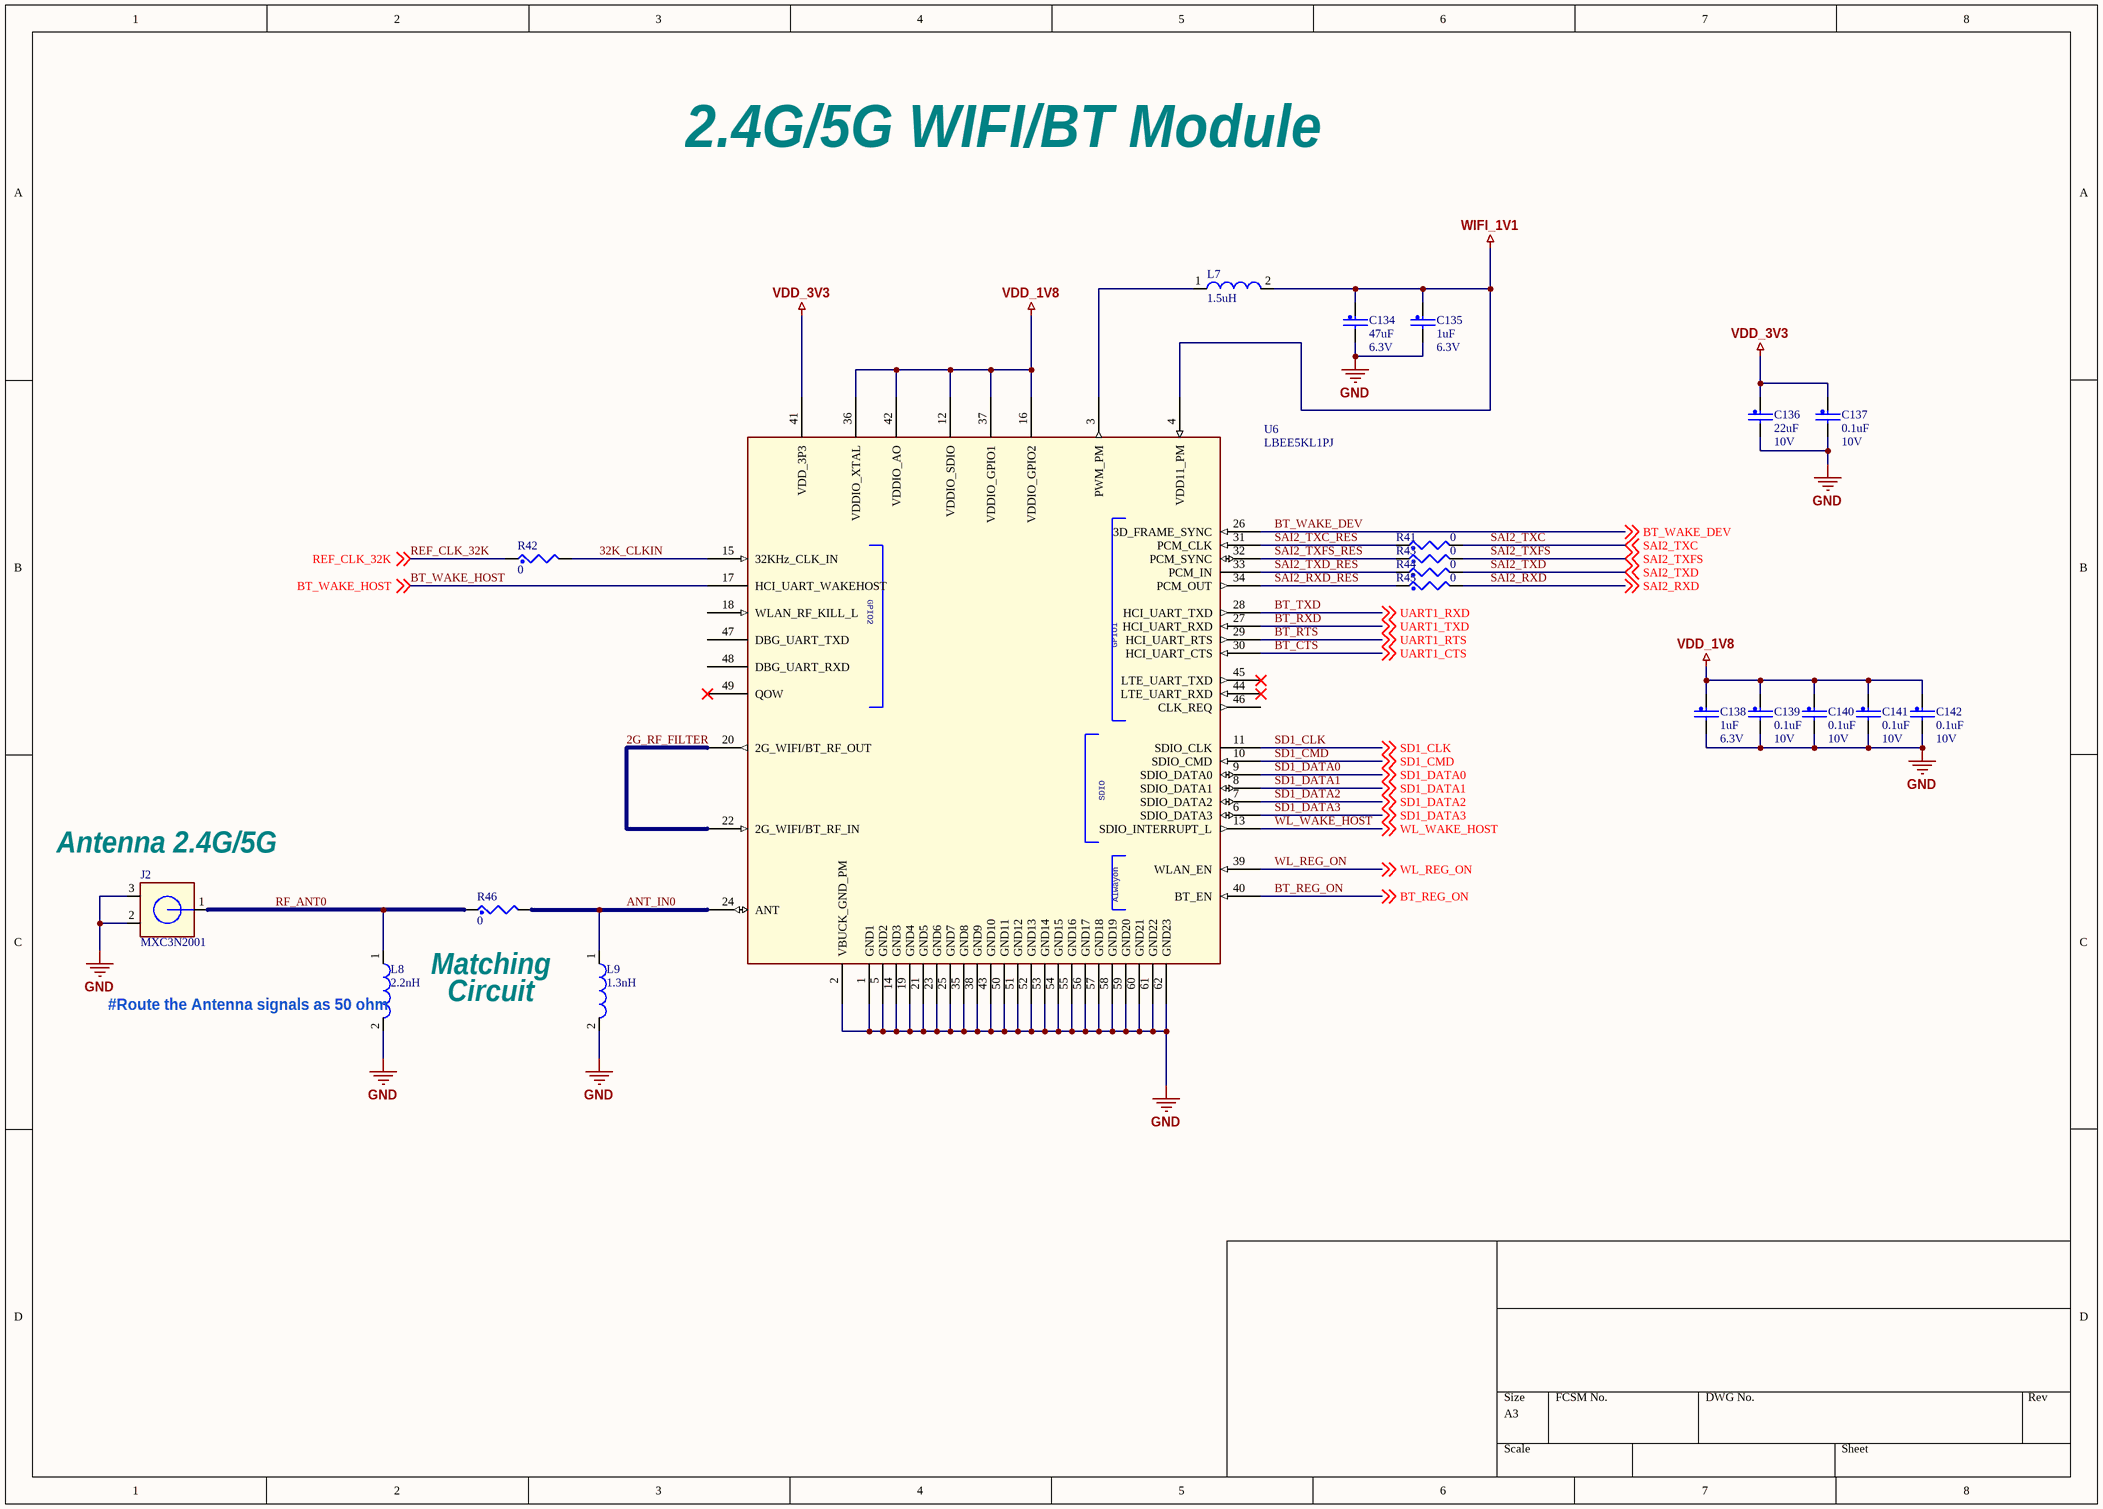
[diagram p7: P[10]WIFI_Bluetooth.SchDoc]

### Parts
C134  47uF  Voltage: 6.3V  [0805_CC]
C135  1uF  Voltage: 6.3V  [0201_CC - C]
C136  22uF  Voltage: 10V  [0603_CC]
C137  0.1uF  Voltage: 10V  [0201_CC - C]
C138  1uF  Voltage: 6.3V  [0201_CC - C]
C139  0.1uF  Voltage: 10V  [0201_CC - C]
C140  0.1uF  Voltage: 10V  [0201_CC - C]
C141  0.1uF  Voltage: 10V  [0201_CC - C]
C142  0.1uF  Voltage: 10V  [0201_CC - C]
J2  MXC3N2001  [CON_3_UFL_R_SMT]
L7  1.5uH  [INDC2016X100N]
L8  2.2nH  [0402_CC_IND]
L9  1.3nH  [0402_CC_IND]
R41  0  [0402_CC]
R42  0  [0402_CC]
R43  0  [0402_CC]
R44  0  [0402_CC]
R45  0  [0402_CC]
R46  0  [0402_CC]
U6  LBEE5KL1PJ  [LQFN62_0P6_7P6X7P4]

### Nets
GND: C134.2 C135.2 C136.2 C137.2 C138.2 C139.2 C140.2 C141.2 C142.2 J2.2(GND1) J2.3(GND2) L8.2 L9.2 U6.1(GND1) U6.2(VBUCK_GND_PM) U6.5(GND2) U6.14(GND3) U6.19(GND4) U6.21(GND5) U6.23(GND6) U6.25(GND7) U6.35(GND8) U6.38(GND9) U6.43(GND10) U6.50(GND11) U6.51(GND12) U6.52(GND13) U6.53(GND14) U6.54(GND15) U6.55(GND16) U6.56(GND17) U6.57(GND18) U6.58(GND19) U6.59(GND20) U6.60(GND21) U6.61(GND22) U6.62(GND23)
VDD_1V8: C138.1 C139.1 C140.1 C141.1 C142.1 U6.12(VDDIO_SDIO) U6.16(VDDIO_GPIO2) U6.36(VDDIO_XTAL) U6.37(VDDIO_GPIO1) U6.42(VDDIO_AO)
VDD_3V3: C136.1 C137.1 U6.41(VDD_3P3)
WIFI_1V1: C134.1 C135.1 L7.2 U6.4(VDD11_PM)
2G_RF_FILTER: U6.20(2G_WIFI/BT_RF_OUT) U6.22(2G_WIFI/BT_RF_IN)
32K_CLKIN: R42.2 U6.15(32KHz_CLK_IN)
ANT_IN0: L9.1 R46.2 U6.24(ANT)
BT_CTS: U6.30(HCI_UART_CTS) ; off-sheet UART1_CTS  [also labelled UART1_CTS]
BT_REG_ON: U6.40(BT_EN) ; off-sheet BT_REG_ON
BT_RTS: U6.29(HCI_UART_RTS) ; off-sheet UART1_RTS  [also labelled UART1_RTS]
BT_RXD: U6.27(HCI_UART_RXD) ; off-sheet UART1_TXD  [also labelled UART1_TXD]
BT_TXD: U6.28(HCI_UART_TXD) ; off-sheet UART1_RXD  [also labelled UART1_RXD]
BT_WAKE_DEV: U6.26(3D_FRAME_SYNC) ; off-sheet BT_WAKE_DEV
BT_WAKE_HOST: U6.17(HCI_UART_WAKEHOST) ; off-sheet BT_WAKE_HOST
REF_CLK_32K: R42.1 ; off-sheet REF_CLK_32K
RF_ANT0: J2.1(CTR) L8.1 R46.1
SAI2_RXD: R45.2 ; off-sheet SAI2_RXD
SAI2_RXD_RES: R45.1 U6.34(PCM_OUT)
SAI2_TXC: R41.2 ; off-sheet SAI2_TXC
SAI2_TXC_RES: R41.1 U6.31(PCM_CLK)
SAI2_TXD: R44.2 ; off-sheet SAI2_TXD
SAI2_TXD_RES: R44.1 U6.33(PCM_IN)
SAI2_TXFS: R43.2 ; off-sheet SAI2_TXFS
SAI2_TXFS_RES: R43.1 U6.32(PCM_SYNC)
SD1_CLK: U6.11(SDIO_CLK) ; off-sheet SD1_CLK
SD1_CMD: U6.10(SDIO_CMD) ; off-sheet SD1_CMD
SD1_DATA0: U6.9(SDIO_DATA0) ; off-sheet SD1_DATA0
SD1_DATA1: U6.8(SDIO_DATA1) ; off-sheet SD1_DATA1
SD1_DATA2: U6.7(SDIO_DATA2) ; off-sheet SD1_DATA2
SD1_DATA3: U6.6(SDIO_DATA3) ; off-sheet SD1_DATA3
WL_REG_ON: U6.39(WLAN_EN) ; off-sheet WL_REG_ON
WL_WAKE_HOST: U6.13(SDIO_INTERRUPT_L) ; off-sheet WL_WAKE_HOST
NetL7_1: L7.1 U6.3(PWM_PM)

Not connected (* = marked no-connect by the designer): U6 18(WLAN_RF_KILL_L) 44(LTE_UART_RXD)* 45(LTE_UART_TXD)* 46(CLK_REQ) 47(DBG_UART_TXD) 48(DBG_UART_RXD) 49(QOW)*

### Notes on the sheet
- 2.4G/5G WIFI/BT Module
- (near J2) Antenna 2.4G/5G
- Matching
- Circuit
- (near L8) #Route the Antenna signals as 50 ohm
- (in symbol LBEE5KL1PJ_QFN62) GPIO2; GPIO1; SDIO; Alwayon

### Library data of the parts
C134-C142 = CAP_NP: CLASS: DISCRETE
J2 = UFL: CON 1 COAX SKT SMT 55H AU\By Arman Arvand; CLASS: IO
L7-L9 = INDUCTOR: CLASS: DISCRETE
R41-R46 = RES: CLASS: DISCRETE
U6 = LBEE5KL1PJ_QFN62: LBEE5KL1PJ_QFN62\By Arman Arvand; CLASS: IC

## Sheet P[11]_CPU_IO.SchDoc
size 513 x 386 mm
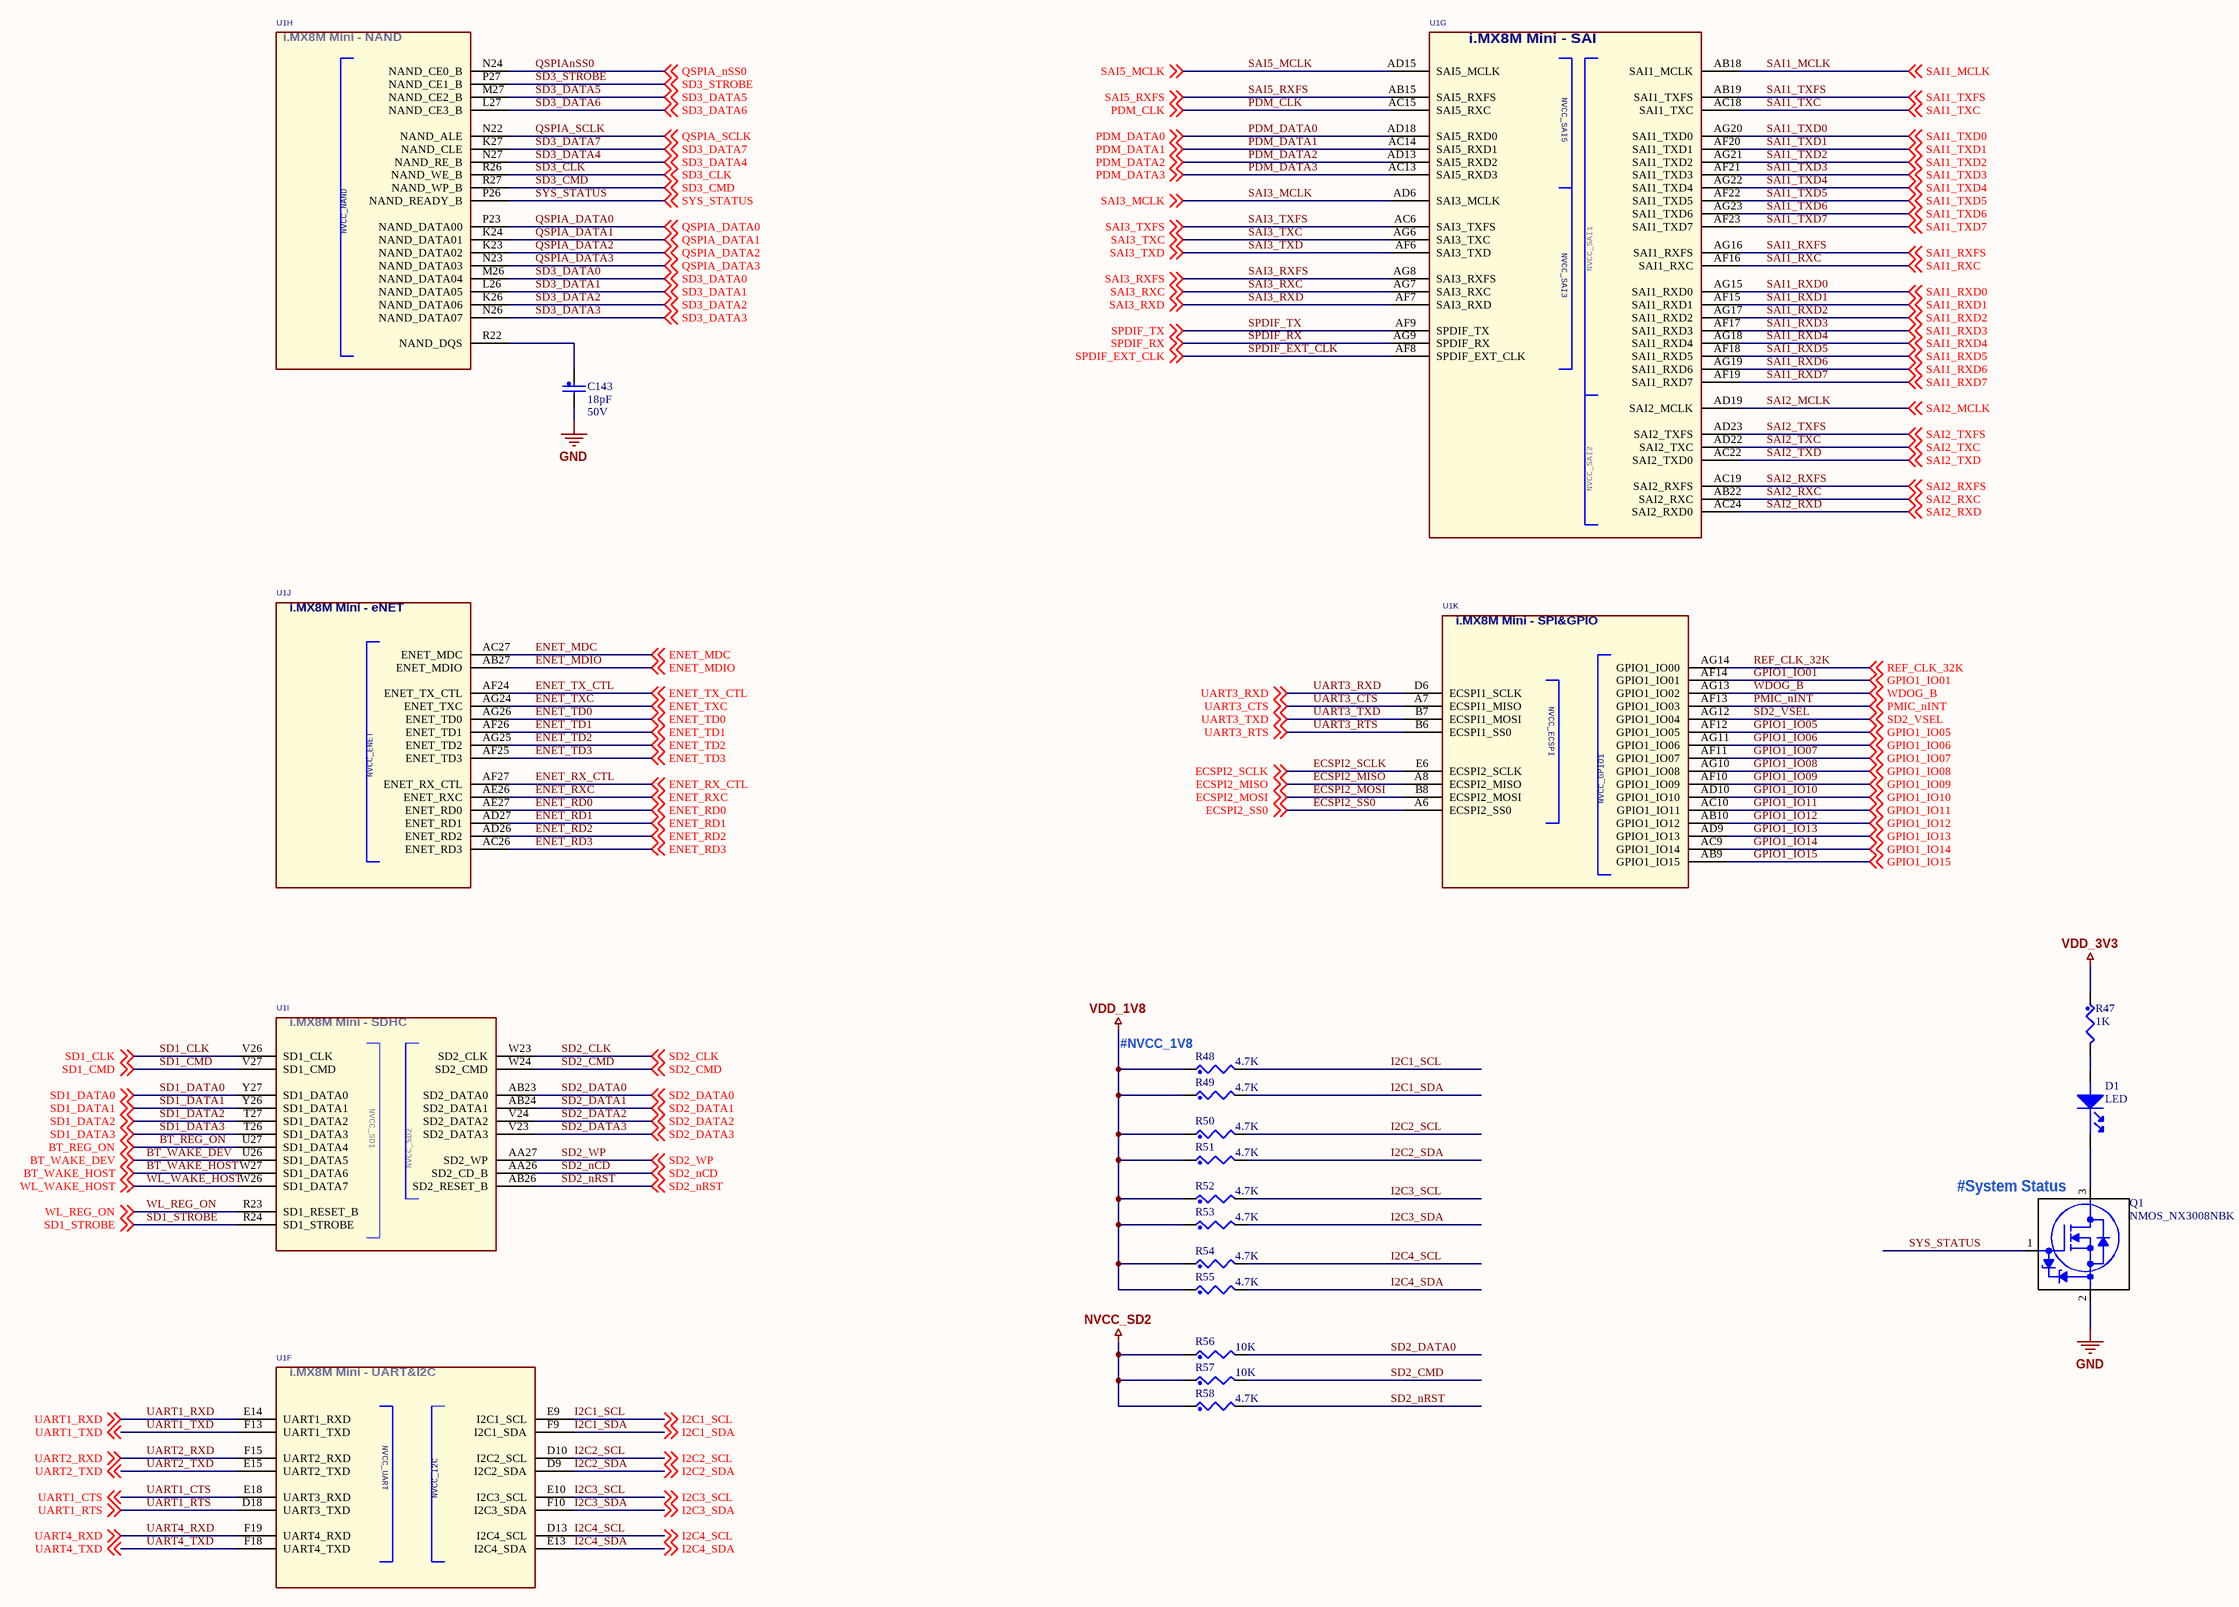
[diagram p8: P[11]_CPU_IO.SchDoc]

### Parts
C143  18pF  Voltage: 50V  [0201_CC - C]
D1  LED  [LED_0603]
Q1  NMOS_NX3008NBK  [SOT65P210X110-3N]
R47  1K  [0201_CC]
R48  4.7K  [0201_CC]
R49  4.7K  [0201_CC]
R50  4.7K  [0201_CC]
R51  4.7K  [0201_CC]
R52  4.7K  [0201_CC]
R53  4.7K  [0201_CC]
R54  4.7K  [0201_CC]
R55  4.7K  [0201_CC]
R56  10K  [0201_CC]
R57  10K  [0201_CC]
R58  4.7K  [0201_CC]
U1  (no value)  [BGA486_0P5_14X14]  (parts F,G,H,I,J,K of 14)

### Nets
GND: C143.2 Q1.2(SOURCE)
NVCC_SD2: R56.1 R57.1 R58.1
VDD_1V8: R48.1 R49.1 R50.1 R51.1 R52.1 R53.1 R54.1 R55.1
VDD_3V3: R47.1
BT_REG_ON: U1.U27(SD1_DATA4) ; off-sheet BT_REG_ON
BT_WAKE_DEV: U1.U26(SD1_DATA5) ; off-sheet BT_WAKE_DEV
BT_WAKE_HOST: U1.W27(SD1_DATA6) ; off-sheet BT_WAKE_HOST
ECSPI2_MISO: U1.A8(ECSPI2_MISO) ; off-sheet ECSPI2_MISO
ECSPI2_MOSI: U1.B8(ECSPI2_MOSI) ; off-sheet ECSPI2_MOSI
ECSPI2_SCLK: U1.E6(ECSPI2_SCLK) ; off-sheet ECSPI2_SCLK
ECSPI2_SS0: U1.A6(ECSPI2_SS0) ; off-sheet ECSPI2_SS0
ENET_MDC: U1.AC27(ENET_MDC) ; off-sheet ENET_MDC
ENET_MDIO: U1.AB27(ENET_MDIO) ; off-sheet ENET_MDIO
ENET_RD0: U1.AE27(ENET_RD0) ; off-sheet ENET_RD0
ENET_RD1: U1.AD27(ENET_RD1) ; off-sheet ENET_RD1
ENET_RD2: U1.AD26(ENET_RD2) ; off-sheet ENET_RD2
ENET_RD3: U1.AC26(ENET_RD3) ; off-sheet ENET_RD3
ENET_RX_CTL: U1.AF27(ENET_RX_CTL) ; off-sheet ENET_RX_CTL
ENET_RXC: U1.AE26(ENET_RXC) ; off-sheet ENET_RXC
ENET_TD0: U1.AG26(ENET_TD0) ; off-sheet ENET_TD0
ENET_TD1: U1.AF26(ENET_TD1) ; off-sheet ENET_TD1
ENET_TD2: U1.AG25(ENET_TD2) ; off-sheet ENET_TD2
ENET_TD3: U1.AF25(ENET_TD3) ; off-sheet ENET_TD3
ENET_TX_CTL: U1.AF24(ENET_TX_CTL) ; off-sheet ENET_TX_CTL
ENET_TXC: U1.AG24(ENET_TXC) ; off-sheet ENET_TXC
GPIO1_IO01: U1.AF14(GPIO1_IO01) ; off-sheet GPIO1_IO01
GPIO1_IO05: U1.AF12(GPIO1_IO05) ; off-sheet GPIO1_IO05
GPIO1_IO06: U1.AG11(GPIO1_IO06) ; off-sheet GPIO1_IO06
GPIO1_IO07: U1.AF11(GPIO1_IO07) ; off-sheet GPIO1_IO07
GPIO1_IO08: U1.AG10(GPIO1_IO08) ; off-sheet GPIO1_IO08
GPIO1_IO09: U1.AF10(GPIO1_IO09) ; off-sheet GPIO1_IO09
GPIO1_IO10: U1.AD10(GPIO1_IO10) ; off-sheet GPIO1_IO10
GPIO1_IO11: U1.AC10(GPIO1_IO11) ; off-sheet GPIO1_IO11
GPIO1_IO12: U1.AB10(GPIO1_IO12) ; off-sheet GPIO1_IO12
GPIO1_IO13: U1.AD9(GPIO1_IO13) ; off-sheet GPIO1_IO13
GPIO1_IO14: U1.AC9(GPIO1_IO14) ; off-sheet GPIO1_IO14
GPIO1_IO15: U1.AB9(GPIO1_IO15) ; off-sheet GPIO1_IO15
I2C1_SCL: R48.2 U1.E9(I2C1_SCL) ; off-sheet I2C1_SCL
I2C1_SDA: R49.2 U1.F9(I2C1_SDA) ; off-sheet I2C1_SDA
I2C2_SCL: R50.2 U1.D10(I2C2_SCL) ; off-sheet I2C2_SCL
I2C2_SDA: R51.2 U1.D9(I2C2_SDA) ; off-sheet I2C2_SDA
I2C3_SCL: R52.2 U1.E10(I2C3_SCL) ; off-sheet I2C3_SCL
I2C3_SDA: R53.2 U1.F10(I2C3_SDA) ; off-sheet I2C3_SDA
I2C4_SCL: R54.2 U1.D13(I2C4_SCL) ; off-sheet I2C4_SCL
I2C4_SDA: R55.2 U1.E13(I2C4_SDA) ; off-sheet I2C4_SDA
PDM_CLK: U1.AC15(SAI5_RXC) ; off-sheet PDM_CLK
PDM_DATA0: U1.AD18(SAI5_RXD0) ; off-sheet PDM_DATA0
PDM_DATA1: U1.AC14(SAI5_RXD1) ; off-sheet PDM_DATA1
PDM_DATA2: U1.AD13(SAI5_RXD2) ; off-sheet PDM_DATA2
PDM_DATA3: U1.AC13(SAI5_RXD3) ; off-sheet PDM_DATA3
PMIC_nINT: U1.AF13(GPIO1_IO03) ; off-sheet PMIC_nINT
QSPIA_DATA0: U1.P23(NAND_DATA00) ; off-sheet QSPIA_DATA0
QSPIA_DATA1: U1.K24(NAND_DATA01) ; off-sheet QSPIA_DATA1
QSPIA_DATA2: U1.K23(NAND_DATA02) ; off-sheet QSPIA_DATA2
QSPIA_DATA3: U1.N23(NAND_DATA03) ; off-sheet QSPIA_DATA3
QSPIA_nSS0: U1.N24(NAND_CE0_B) ; off-sheet QSPIA_nSS0  [also labelled QSPIAnSS0]
QSPIA_SCLK: U1.N22(NAND_ALE) ; off-sheet QSPIA_SCLK
REF_CLK_32K: U1.AG14(GPIO1_IO00) ; off-sheet REF_CLK_32K
SAI1_MCLK: U1.AB18(SAI1_MCLK) ; off-sheet SAI1_MCLK
SAI1_RXC: U1.AF16(SAI1_RXC) ; off-sheet SAI1_RXC
SAI1_RXD0: U1.AG15(SAI1_RXD0) ; off-sheet SAI1_RXD0
SAI1_RXD1: U1.AF15(SAI1_RXD1) ; off-sheet SAI1_RXD1
SAI1_RXD2: U1.AG17(SAI1_RXD2) ; off-sheet SAI1_RXD2
SAI1_RXD3: U1.AF17(SAI1_RXD3) ; off-sheet SAI1_RXD3
SAI1_RXD4: U1.AG18(SAI1_RXD4) ; off-sheet SAI1_RXD4
SAI1_RXD5: U1.AF18(SAI1_RXD5) ; off-sheet SAI1_RXD5
SAI1_RXD6: U1.AG19(SAI1_RXD6) ; off-sheet SAI1_RXD6
SAI1_RXD7: U1.AF19(SAI1_RXD7) ; off-sheet SAI1_RXD7
SAI1_RXFS: U1.AG16(SAI1_RXFS) ; off-sheet SAI1_RXFS
SAI1_TXC: U1.AC18(SAI1_TXC) ; off-sheet SAI1_TXC
SAI1_TXD0: U1.AG20(SAI1_TXD0) ; off-sheet SAI1_TXD0
SAI1_TXD1: U1.AF20(SAI1_TXD1) ; off-sheet SAI1_TXD1
SAI1_TXD2: U1.AG21(SAI1_TXD2) ; off-sheet SAI1_TXD2
SAI1_TXD3: U1.AF21(SAI1_TXD3) ; off-sheet SAI1_TXD3
SAI1_TXD4: U1.AG22(SAI1_TXD4) ; off-sheet SAI1_TXD4
SAI1_TXD5: U1.AF22(SAI1_TXD5) ; off-sheet SAI1_TXD5
SAI1_TXD6: U1.AG23(SAI1_TXD6) ; off-sheet SAI1_TXD6
SAI1_TXD7: U1.AF23(SAI1_TXD7) ; off-sheet SAI1_TXD7
SAI1_TXFS: U1.AB19(SAI1_TXFS) ; off-sheet SAI1_TXFS
SAI2_MCLK: U1.AD19(SAI2_MCLK) ; off-sheet SAI2_MCLK
SAI2_RXC: U1.AB22(SAI2_RXC) ; off-sheet SAI2_RXC
SAI2_RXD: U1.AC24(SAI2_RXD0) ; off-sheet SAI2_RXD
SAI2_RXFS: U1.AC19(SAI2_RXFS) ; off-sheet SAI2_RXFS
SAI2_TXC: U1.AD22(SAI2_TXC) ; off-sheet SAI2_TXC
SAI2_TXD: U1.AC22(SAI2_TXD0) ; off-sheet SAI2_TXD
SAI2_TXFS: U1.AD23(SAI2_TXFS) ; off-sheet SAI2_TXFS
SAI3_MCLK: U1.AD6(SAI3_MCLK) ; off-sheet SAI3_MCLK
SAI3_RXC: U1.AG7(SAI3_RXC) ; off-sheet SAI3_RXC
SAI3_RXD: U1.AF7(SAI3_RXD) ; off-sheet SAI3_RXD
SAI3_RXFS: U1.AG8(SAI3_RXFS) ; off-sheet SAI3_RXFS
SAI3_TXC: U1.AG6(SAI3_TXC) ; off-sheet SAI3_TXC
SAI3_TXD: U1.AF6(SAI3_TXD) ; off-sheet SAI3_TXD
SAI3_TXFS: U1.AC6(SAI3_TXFS) ; off-sheet SAI3_TXFS
SAI5_MCLK: U1.AD15(SAI5_MCLK) ; off-sheet SAI5_MCLK
SAI5_RXFS: U1.AB15(SAI5_RXFS) ; off-sheet SAI5_RXFS
SD1_CLK: U1.V26(SD1_CLK) ; off-sheet SD1_CLK
SD1_CMD: U1.V27(SD1_CMD) ; off-sheet SD1_CMD
SD1_DATA0: U1.Y27(SD1_DATA0) ; off-sheet SD1_DATA0
SD1_DATA1: U1.Y26(SD1_DATA1) ; off-sheet SD1_DATA1
SD1_DATA2: U1.T27(SD1_DATA2) ; off-sheet SD1_DATA2
SD1_DATA3: U1.T26(SD1_DATA3) ; off-sheet SD1_DATA3
SD1_STROBE: U1.R24(SD1_STROBE) ; off-sheet SD1_STROBE
SD2_CLK: U1.W23(SD2_CLK) ; off-sheet SD2_CLK
SD2_CMD: R57.2 U1.W24(SD2_CMD) ; off-sheet SD2_CMD
SD2_DATA0: R56.2 U1.AB23(SD2_DATA0) ; off-sheet SD2_DATA0
SD2_DATA1: U1.AB24(SD2_DATA1) ; off-sheet SD2_DATA1
SD2_DATA2: U1.V24(SD2_DATA2) ; off-sheet SD2_DATA2
SD2_DATA3: U1.V23(SD2_DATA3) ; off-sheet SD2_DATA3
SD2_nCD: U1.AA26(SD2_CD_B) ; off-sheet SD2_nCD
SD2_nRST: R58.2 U1.AB26(SD2_RESET_B) ; off-sheet SD2_nRST
SD2_VSEL: U1.AG12(GPIO1_IO04) ; off-sheet SD2_VSEL
SD2_WP: U1.AA27(SD2_WP) ; off-sheet SD2_WP
SD3_CLK: U1.R26(NAND_WE_B) ; off-sheet SD3_CLK
SD3_CMD: U1.R27(NAND_WP_B) ; off-sheet SD3_CMD
SD3_DATA0: U1.M26(NAND_DATA04) ; off-sheet SD3_DATA0
SD3_DATA1: U1.L26(NAND_DATA05) ; off-sheet SD3_DATA1
SD3_DATA2: U1.K26(NAND_DATA06) ; off-sheet SD3_DATA2
SD3_DATA3: U1.N26(NAND_DATA07) ; off-sheet SD3_DATA3
SD3_DATA4: U1.N27(NAND_RE_B) ; off-sheet SD3_DATA4
SD3_DATA5: U1.M27(NAND_CE2_B) ; off-sheet SD3_DATA5
SD3_DATA6: U1.L27(NAND_CE3_B) ; off-sheet SD3_DATA6
SD3_DATA7: U1.K27(NAND_CLE) ; off-sheet SD3_DATA7
SD3_STROBE: U1.P27(NAND_CE1_B) ; off-sheet SD3_STROBE
SPDIF_EXT_CLK: U1.AF8(SPDIF_EXT_CLK) ; off-sheet SPDIF_EXT_CLK
SPDIF_RX: U1.AG9(SPDIF_RX) ; off-sheet SPDIF_RX
SPDIF_TX: U1.AF9(SPDIF_TX) ; off-sheet SPDIF_TX
SYS_STATUS: Q1.1(GATE) U1.P26(NAND_READY_B) ; off-sheet SYS_STATUS
UART1_CTS: U1.E18(UART3_RXD) ; off-sheet UART1_CTS  [project net BT_CTS]
UART1_RTS: U1.D18(UART3_TXD) ; off-sheet UART1_RTS  [project net BT_RTS]
UART1_RXD: U1.E14(UART1_RXD) ; off-sheet UART1_RXD  [project net BT_TXD]
UART1_TXD: U1.F13(UART1_TXD) ; off-sheet UART1_TXD  [project net BT_RXD]
UART2_RXD: U1.F15(UART2_RXD) ; off-sheet UART2_RXD
UART2_TXD: U1.E15(UART2_TXD) ; off-sheet UART2_TXD
UART3_CTS: U1.A7(ECSPI1_MISO) ; off-sheet UART3_CTS
UART3_RTS: U1.B6(ECSPI1_SS0) ; off-sheet UART3_RTS
UART3_RXD: U1.D6(ECSPI1_SCLK) ; off-sheet UART3_RXD
UART3_TXD: U1.B7(ECSPI1_MOSI) ; off-sheet UART3_TXD
UART4_RXD: U1.F19(UART4_RXD) ; off-sheet UART4_RXD
UART4_TXD: U1.F18(UART4_TXD) ; off-sheet UART4_TXD
WDOG_B: U1.AG13(GPIO1_IO02) ; off-sheet WDOG_B
WL_REG_ON: U1.R23(SD1_RESET_B) ; off-sheet WL_REG_ON
WL_WAKE_HOST: U1.W26(SD1_DATA7) ; off-sheet WL_WAKE_HOST
NetC143_1: C143.1 U1.R22(NAND_DQS)
NetD1_A: D1.A(ANODE) R47.2
NetD1_C: D1.C(CATHODE) Q1.3(DRAIN)

### Notes on the sheet
- (near R48) #NVCC_1V8
- (near Q1) #System Status
- (in symbol MIMX8MM_BGA486P, part F) i.MX8M Mini - UART&I2C
- (in symbol MIMX8MM_BGA486P, part G) i.MX8M Mini - SAI
- (in symbol MIMX8MM_BGA486P, part H) i.MX8M Mini - NAND
- (in symbol MIMX8MM_BGA486P, part I) i.MX8M Mini - SDHC
- (in symbol MIMX8MM_BGA486P, part J) i.MX8M Mini - eNET
- (in symbol MIMX8MM_BGA486P, part K) i.MX8M Mini - SPI&GPIO

### Library data of the parts
C143 = CAP_NP: CLASS: DISCRETE
D1 = LED: CLASS: IC
Q1 = NMOS_NX3008NBK: NMOS_NX3008NBK\AAR; CLASS: IC
R47-R58 = RES: CLASS: DISCRETE
U1 = MIMX8MM_BGA486P: as U1 on sheet P[04]_CPU_POWER; CLASS: IC; HEIGHT: 1.25MM; ROHS: Yes